# EAGLE design canSlaveV01a0 (EAGLE 6.3)

## Sheet 1 of 6
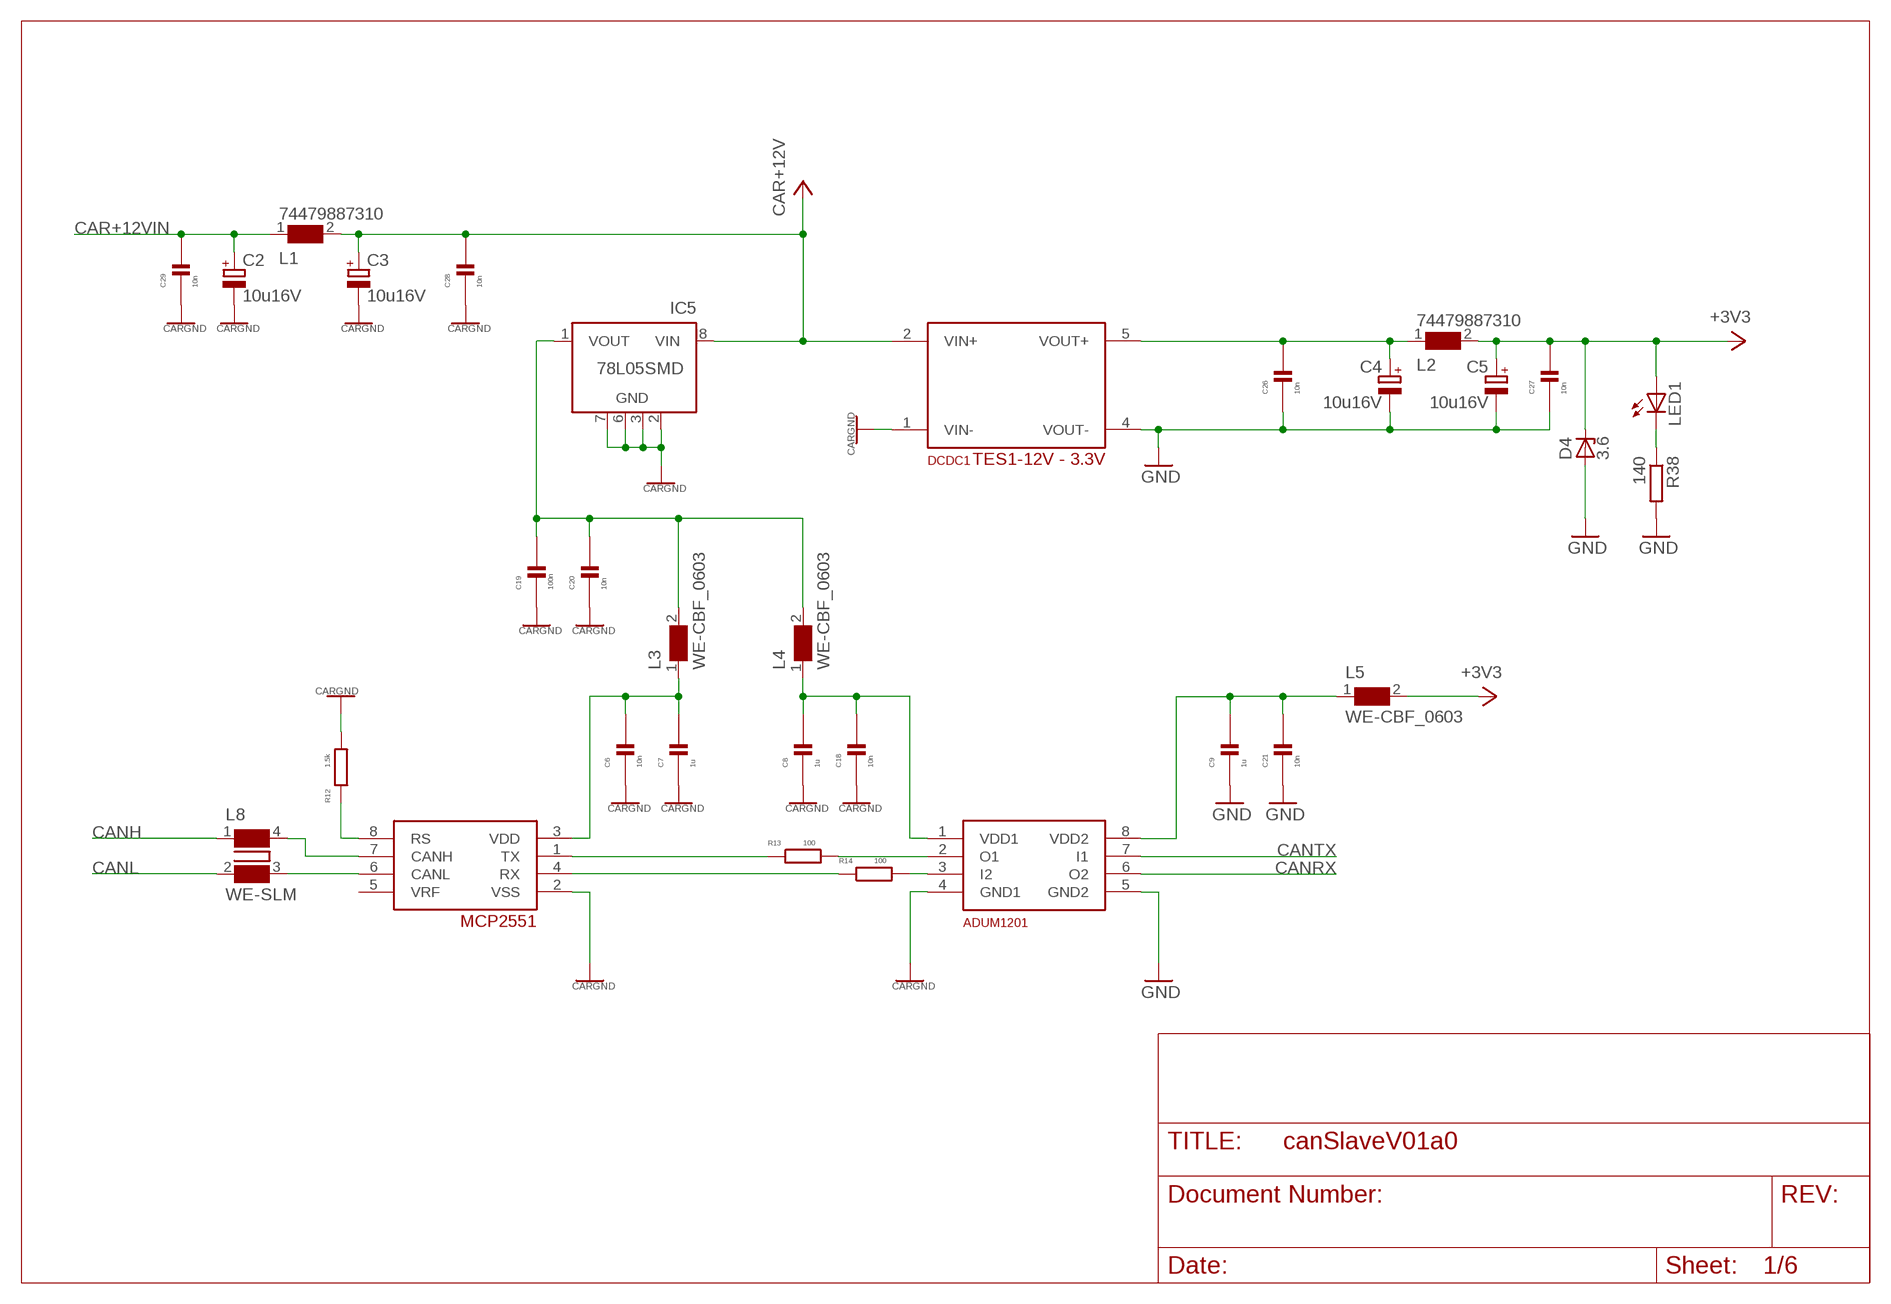
[diagram p0: schematic, sheet 1]

### Parts
C2  10u16V  CPOL-EUB  [PANASONIC_B]
C3  10u16V  CPOL-EUB  [PANASONIC_B]
C4  10u16V  CPOL-EUB  [PANASONIC_B]
C5  10u16V  CPOL-EUB  [PANASONIC_B]
C6  10n  C0603  [C0603]
C7  1u  C0603  [C0603]
C8  1u  C0603  [C0603]
C9  1u  C0603  [C0603]
C18  10n  C0603  [C0603]
C19  100n  C0603  [C0603]
C20  10n  C0603  [C0603]
C21  10n  C0603  [C0603]
C26  10n  C0603  [C0603]
C27  10n  C0603  [C0603]
C28  10n  C0603  [C0603]
C29  10n  C0603  [C0603]
D4  3.6  ZENER-DIODESOD323  [SOD323-W]
DCDC1  TES1-12V - 3.3V  ISFXXXXA  [ISF]
IC3  ADUM1201  [SO-8]
IC4  MCP2551  [SO-8]
IC5  78L05SMD  [SO08]
L1  74479887310  WE-PMI_1008  [WE-PMI_1008]
L2  74479887310  WE-PMI_1008  [WE-PMI_1008]
L3  WE-CBF_0603  [0603]
L4  WE-CBF_0603  [0603]
L5  WE-CBF_0603  [0603]
L8  WE-SLM  [WE-SLM]
LED1  LEDCHIPLED_1206  [CHIPLED_1206]
R12  1.5k  R0603  [R0603]
R13  100  R0603  [R0603]
R14  100  R0603  [R0603]
R38  140  R-EU_R1206  [R1206]

### Nets
+3V3: C5.+ C27.1 D4.C L2.2 L5.2 LED1.A ; also sheet 2,3,5
+3V3_AD: C9.1 C21.1 IC3.8(VDD2) L5.1
+3V3DCOUT: C4.+ C26.1 DCDC1.5(VOUT+) L2.1
CANH: L8.1 ; also sheet 6
CANHC: IC4.7(CANH) L8.4
CANL: L8.2 ; also sheet 6
CANLC: IC4.6(CANL) L8.3
CANRX: IC3.6(O2) ; also sheet 2
CANTX: IC3.7(I1) ; also sheet 2
CAR+5V: C19.1 C20.1 IC5.1(VOUT) L3.2 L4.2
CAR+5V_AD: C8.1 C18.1 IC3.1(VDD1) L4.1
CAR+5V_CT: C6.1 C7.1 IC4.3(VDD) L3.1
CAR+12V: C3.+ C28.1 DCDC1.2(VIN+) IC5.8(VIN) L1.2
CAR+12VIN: C2.+ C29.1 L1.1 ; also sheet 6
CAR_CANRX: IC3.3(I2) R14.2
CAR_CANRX_T: IC4.4(RX) R14.1
CAR_CANTX: IC3.2(O1) R13.2
CAR_CANTX_T: IC4.1(TX) R13.1
CARGND: C2.- C3.- C6.2 C7.2 C8.2 C18.2 C19.2 C20.2 C28.2 C29.2 DCDC1.1(VIN-) IC3.4(GND1) IC4.2(VSS) IC5.2(GND) IC5.3(GND) IC5.6(GND) IC5.7(GND) R12.2 ; also sheet 6
GND: C4.- C5.- C9.2 C21.2 C26.2 C27.2 D4.A DCDC1.4(VOUT-) IC3.5(GND2) R38.2 ; also sheet 2,3,5,6
LED1C: LED1.C R38.1
RS: IC4.8(RS) R12.1
Unconnected: IC4.5(VRF) IC5.4(NC) IC5.5(NC)

## Sheet 2 of 6
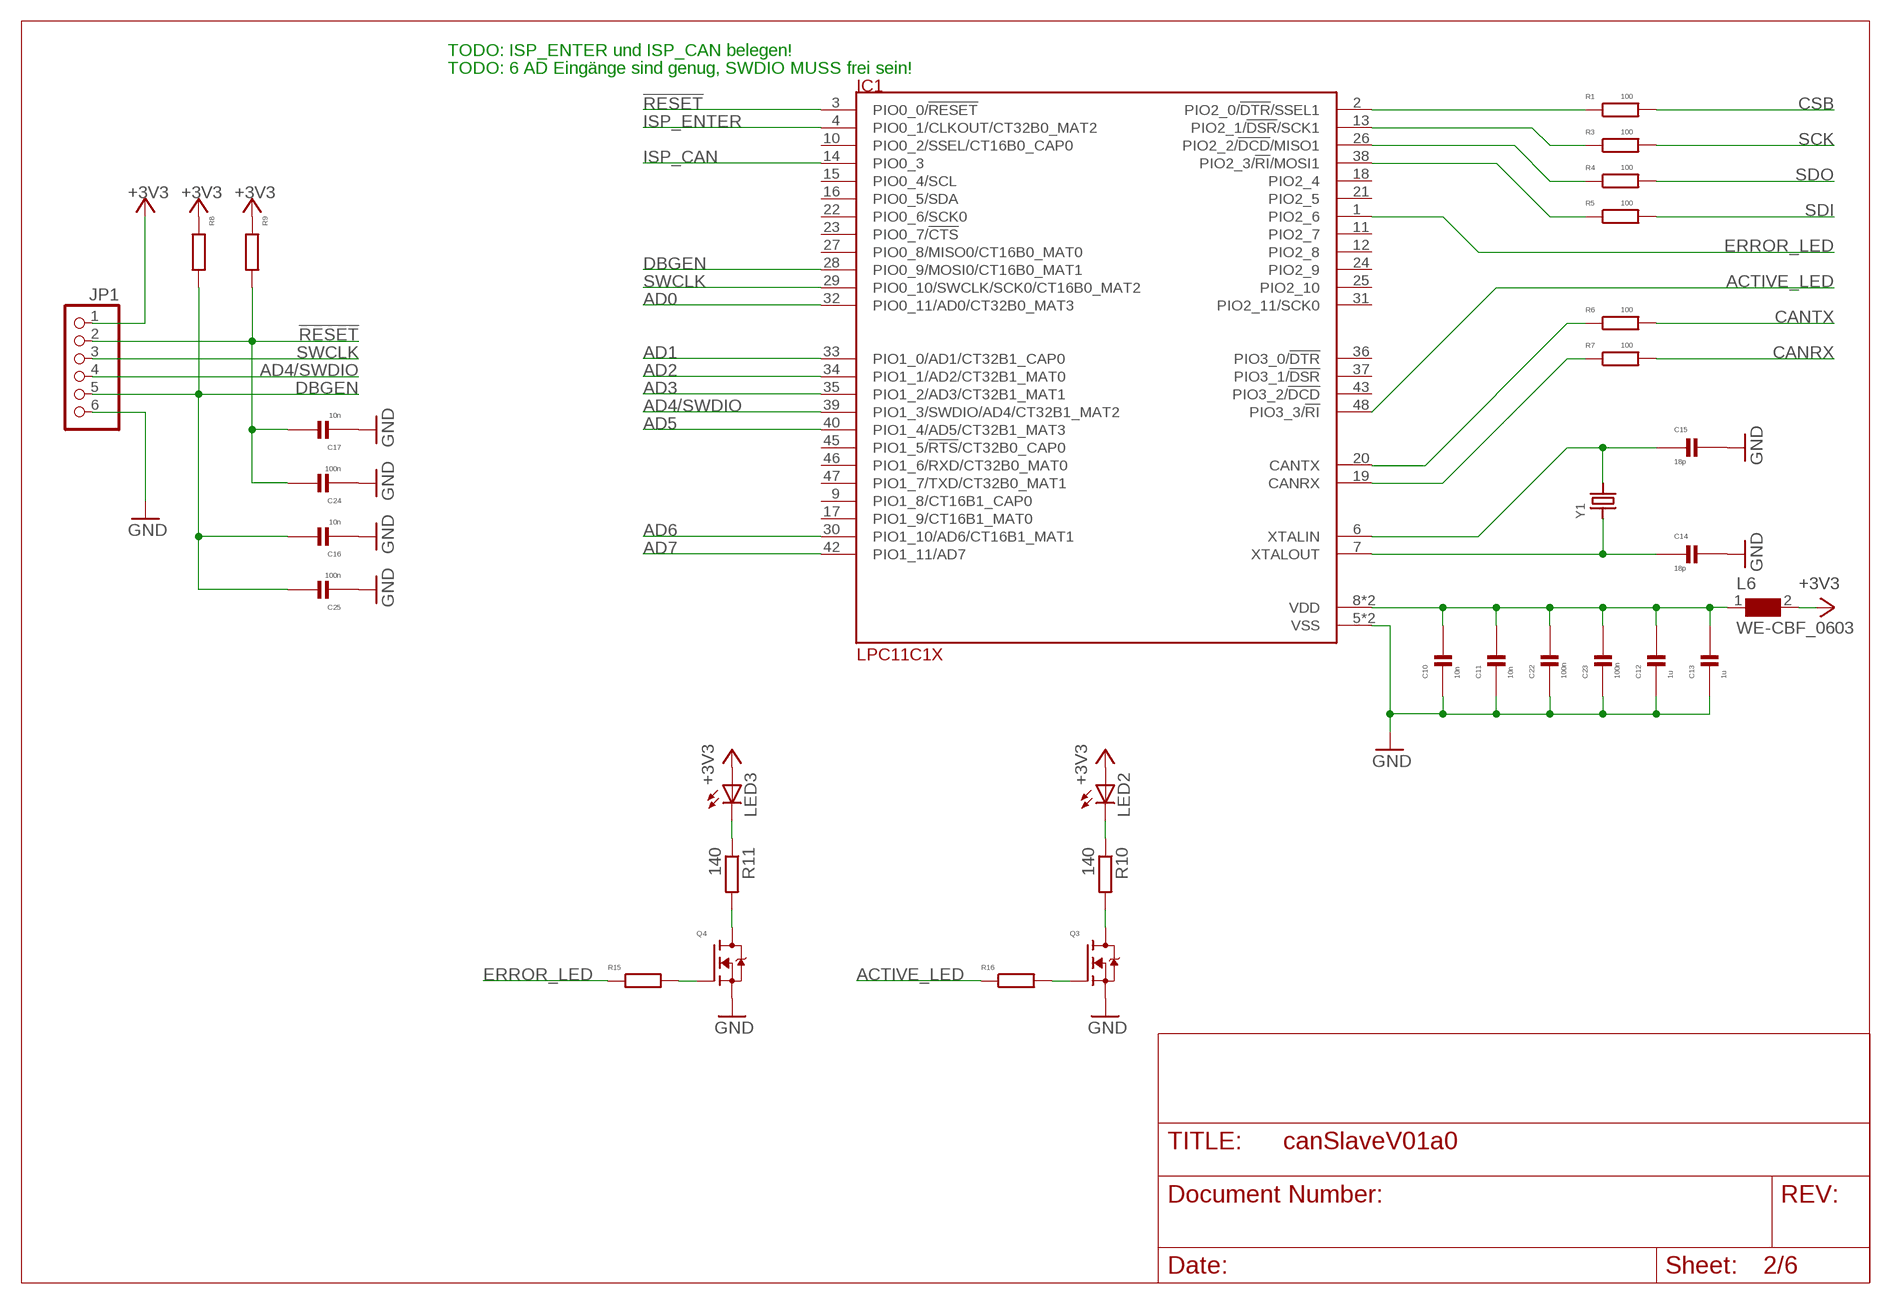
[diagram p1: schematic, sheet 2]

### Parts
C10  10n  C0603  [C0603]
C11  10n  C0603  [C0603]
C12  1u  C0603  [C0603]
C13  1u  C0603  [C0603]
C14  18p  C0603  [C0603]
C15  18p  C0603  [C0603]
C16  10n  C0603  [C0603]
C17  10n  C0603  [C0603]
C22  100n  C0603  [C0603]
C23  100n  C0603  [C0603]
C24  100n  C0603  [C0603]
C25  100n  C0603  [C0603]
IC1  LPC11C1X  [LQFP48]
JP1  PINHD-1X6  [1X06]
L6  WE-CBF_0603  [0603]
LED2  LEDCHIPLED_1206  [CHIPLED_1206]
LED3  LEDCHIPLED_1206  [CHIPLED_1206]
Q3  2N7002  [SOT23]
Q4  2N7002  [SOT23]
R1  100  R0603  [R0603]
R3  100  R0603  [R0603]
R4  100  R0603  [R0603]
R5  100  R0603  [R0603]
R6  100  R0603  [R0603]
R7  100  R0603  [R0603]
R8  R0603  [R0603]
R9  R0603  [R0603]
R10  140  R-EU_R1206  [R1206]
R11  140  R-EU_R1206  [R1206]
R15  R0603  [R0603]
R16  R0603  [R0603]
Y1  CRYSTALTHIN  [CRYSTAL_3.2X2.5]

### Nets
!RESET: C17.1 C24.1 IC1.3(PIO0_0/!RESET) JP1.2 R9.2
+3V3: JP1.1 L6.2 LED2.A LED3.A R8.1 R9.1 ; also sheet 1,3,5
+3V3_UC: C10.1 C11.1 C12.1 C13.1 C22.1 C23.1 IC1.8(VDD) IC1.44(VDD) L6.1
ACTIVE_LED: IC1.48(PIO3_3/!RI) R16.1
ACTIVE_LED_G: Q3.1(G) R16.2
AD0: IC1.32(PIO0_11/AD0/CT32B0_MAT3) ; also sheet 5,6
AD1: IC1.33(PIO1_0/AD1/CT32B1_CAP0) ; also sheet 5,6
AD2: IC1.34(PIO1_1/AD2/CT32B1_MAT0) ; also sheet 5,6
AD3: IC1.35(PIO1_2/AD3/CT32B1_MAT1) ; also sheet 5,6
AD4/SWDIO: IC1.39(PIO1_3/SWDIO/AD4/CT32B1_MAT2) JP1.4 ; also sheet 5,6
AD5: IC1.40(PIO1_4/AD5/CT32B1_MAT3) ; also sheet 5,6
AD6: IC1.30(PIO1_10/AD6/CT16B1_MAT1) ; also sheet 5,6
AD7: IC1.42(PIO1_11/AD7) ; also sheet 5,6
CANRX: R7.2 ; also sheet 1
CANRX_U: IC1.19(CANRX) R7.1
CANTX: R6.2 ; also sheet 1
CANTX_U: IC1.20(CANTX) R6.1
CSB: R1.2 ; also sheet 3
DBGEN: C16.1 C25.1 IC1.28(PIO0_9/MOSI0/CT16B0_MAT1) JP1.5 R8.2
ERROR_LED: IC1.1(PIO2_6) R15.1
ERROR_LED_G: Q4.1(G) R15.2
GND: C10.2 C11.2 C12.2 C13.2 C14.1 C15.1 C16.2 C17.2 C22.2 C23.2 C24.2 C25.2 IC1.5(VSS) IC1.41(VSS) JP1.6 Q3.2(S) Q4.2(S) ; also sheet 1,3,5,6
ISP_CAN: IC1.14(PIO0_3)
ISP_ENTER: IC1.4(PIO0_1/CLKOUT/CT32B0_MAT2)
LED1C1: LED2.C R10.1
LED1C2: LED3.C R11.1
MISO1: IC1.26(PIO2_2/!DCD!/MISO1) R4.1
MOSI1: IC1.38(PIO2_3/!RI!/MOSI1) R5.1
Q3_COL: Q3.3(D) R10.2
Q3_COL1: Q4.3(D) R11.2
SCK: R3.2 ; also sheet 3
SCK1: IC1.13(PIO2_1/!DSR!/SCK1) R3.1
SDI: R5.2 ; also sheet 3
SDO: R4.2 ; also sheet 3
SSEL: IC1.2(PIO2_0/!DTR!/SSEL1) R1.1
SWCLK: IC1.29(PIO0_10/SWCLK/SCK0/CT16B0_MAT2) JP1.3
XTALIN: C15.2 IC1.6(XTALIN) Y1.2
XTALOUT: C14.2 IC1.7(XTALOUT) Y1.1
Unconnected: IC1.9(PIO1_8/CT16B1_CAP0) IC1.10(PIO0_2/SSEL/CT16B0_CAP0) IC1.11(PIO2_7) IC1.12(PIO2_8) IC1.15(PIO0_4/SCL) IC1.16(PIO0_5/SDA) IC1.17(PIO1_9/CT16B1_MAT0) IC1.18(PIO2_4) IC1.21(PIO2_5) IC1.22(PIO0_6/SCK0) IC1.23(PIO0_7/!CTS) IC1.24(PIO2_9) IC1.25(PIO2_10) IC1.27(PIO0_8/MISO0/CT16B0_MAT0) IC1.31(PIO2_11/SCK0) IC1.36(PIO3_0/!DTR) IC1.37(PIO3_1/!DSR) IC1.43(PIO3_2/!DCD) IC1.45(PIO1_5/!RTS!/CT32B0_CAP0) IC1.46(PIO1_6/RXD/CT32B0_MAT0) IC1.47(PIO1_7/TXD/CT32B0_MAT1)

### Notes on the sheet
- TODO: ISP_ENTER und ISP_CAN belegen!
- TODO: 6 AD Eingänge sind genug, SWDIO MUSS frei sein!

## Sheet 3 of 6
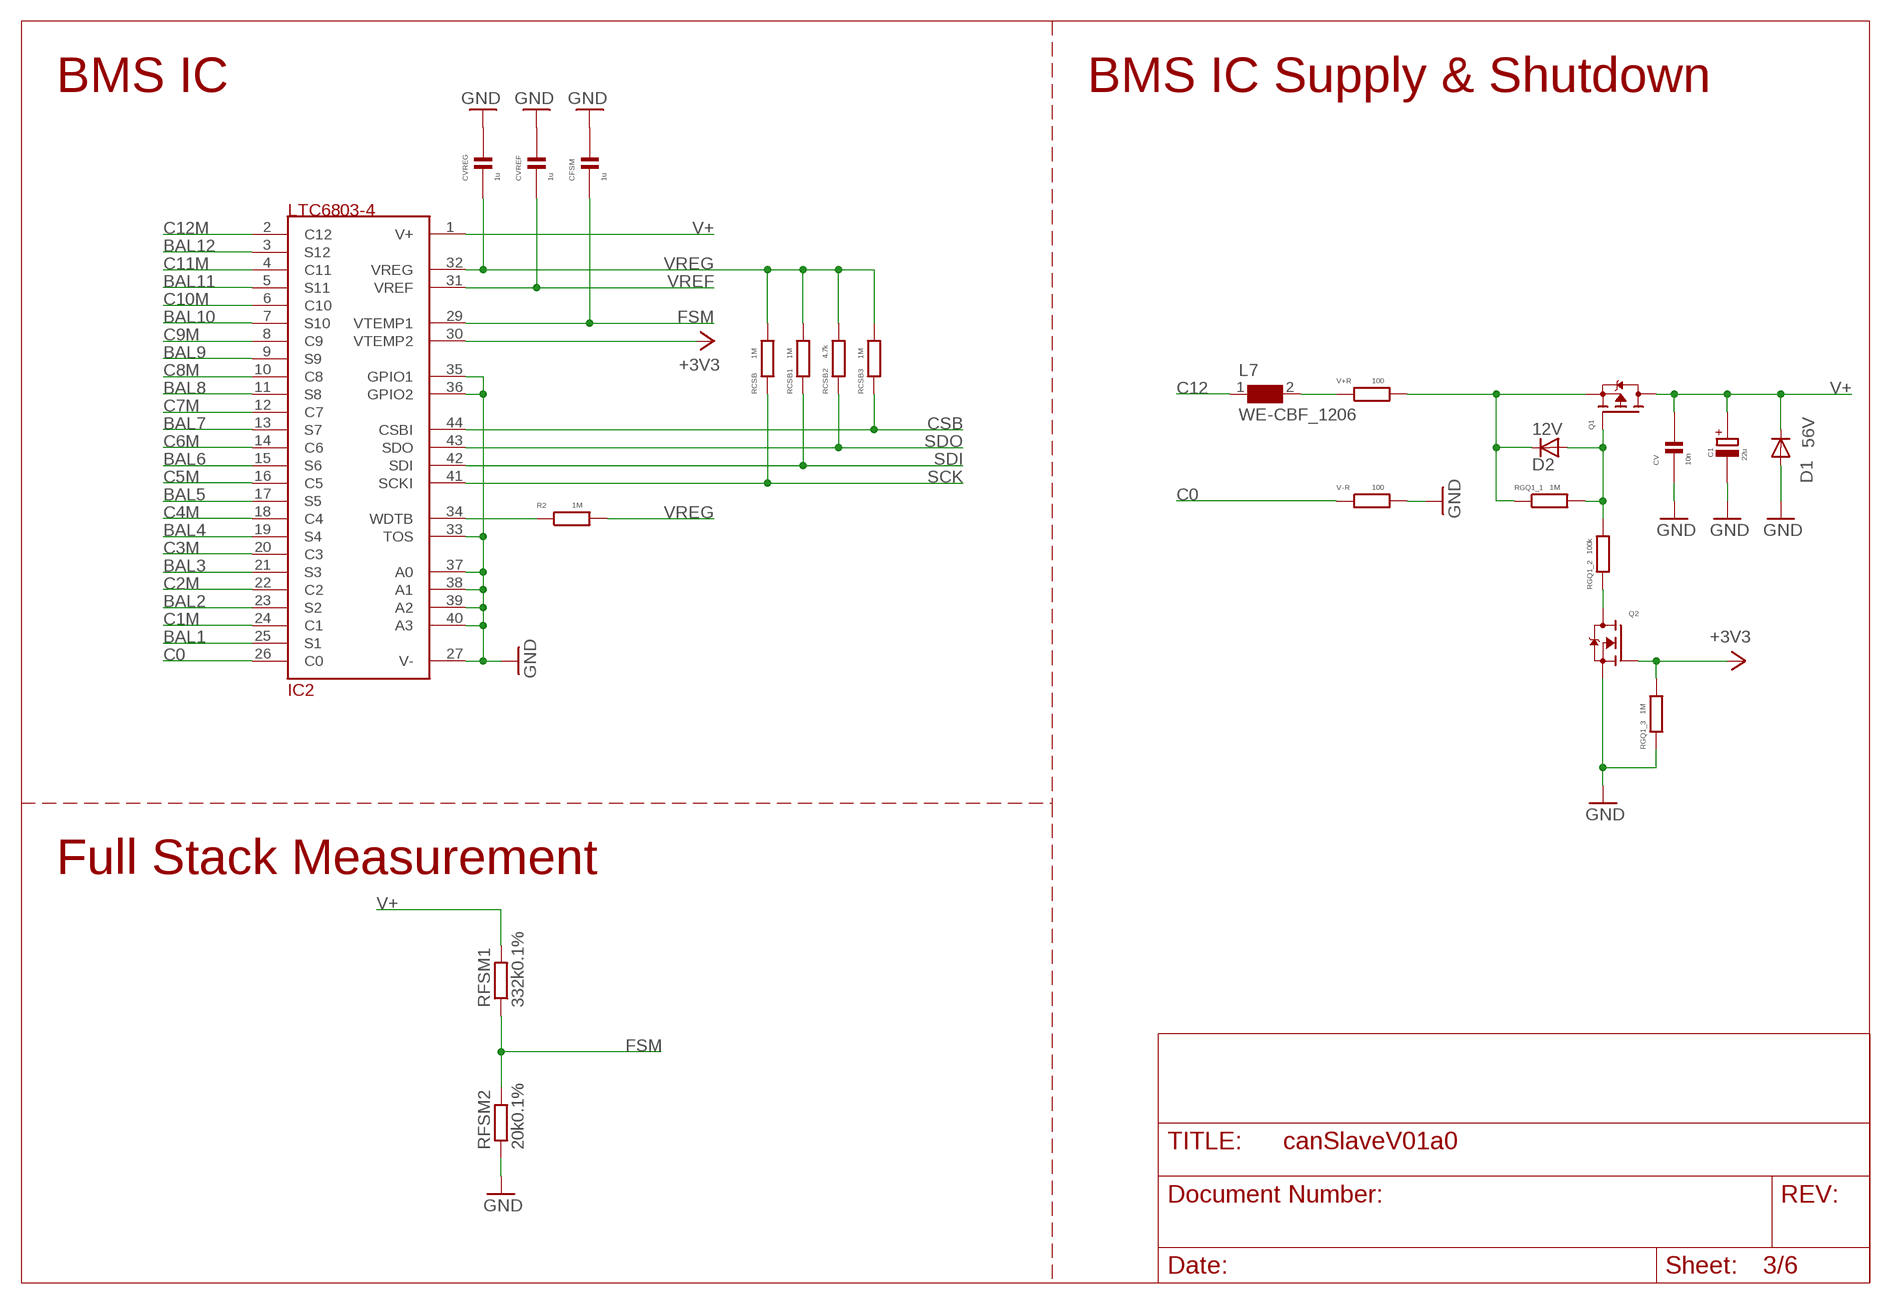
[diagram p2: schematic, sheet 3]

### Parts
C1  22u  CPOLEF  [PANASONIC_F]
CFSM  1u  C0603  [C0603]
CV  10n  C1206  [C1206]
CVREF  1u  C0603  [C0603]
CVREG  1u  C0603  [C0603]
D1  56V  DIODE-SOD123  [SOD123]
D2  12V  DIODE-SOD323-R  [SOD323-R]
IC2  LTC6803-4  [44SSOP]
L7  WE-CBF_1206  [1206]
Q1  TP0610K  [SOT23]
Q2  2N7002  [SOT23]
R2  1M  R0603  [R0603]
RCSB  1M  R0603  [R0603]
RCSB1  1M  R0603  [R0603]
RCSB2  4.7k  R0603  [R0603]
RCSB3  1M  R0603  [R0603]
RFSM1  332k0.1%  R-EU_R0603  [R0603]
RFSM2  20k0.1%  R-EU_R0603  [R0603]
RGQ1_1  1M  R0805  [R0805]
RGQ1_2  100k  R0805  [R0805]
RGQ1_3  1M  R0603  [R0603]
V+R  100  R0805  [R0805]
V-R  100  R0805  [R0805]

### Nets
+3V3: IC2.30(VTEMP2) Q2.1(G) RGQ1_3.2 ; also sheet 1,2,5
BAL1: IC2.25(S1) ; also sheet 4
BAL2: IC2.23(S2) ; also sheet 4
BAL3: IC2.21(S3) ; also sheet 4
BAL4: IC2.19(S4) ; also sheet 4
BAL5: IC2.17(S5) ; also sheet 4
BAL6: IC2.15(S6) ; also sheet 4
BAL7: IC2.13(S7) ; also sheet 4
BAL8: IC2.11(S8) ; also sheet 4
BAL9: IC2.9(S9) ; also sheet 4
BAL10: IC2.7(S10) ; also sheet 4
BAL11: IC2.5(S11) ; also sheet 4
BAL12: IC2.3(S12) ; also sheet 4
C0: IC2.26(C0) V-R.1 ; also sheet 4,6
C1M: IC2.24(C1) ; also sheet 4
C2M: IC2.22(C2) ; also sheet 4
C3M: IC2.20(C3) ; also sheet 4
C4M: IC2.18(C4) ; also sheet 4
C5M: IC2.16(C5) ; also sheet 4
C6M: IC2.14(C6) ; also sheet 4
C7M: IC2.12(C7) ; also sheet 4
C8M: IC2.10(C8) ; also sheet 4
C9M: IC2.8(C9) ; also sheet 4
C10M: IC2.6(C10) ; also sheet 4
C11M: IC2.4(C11) ; also sheet 4
C12: L7.1 ; also sheet 4,6
C12F: L7.2 V+R.1
C12M: IC2.2(C12) ; also sheet 4
CSB: IC2.44(CSBI) RCSB3.1 ; also sheet 2
FSM: CFSM.2 IC2.29(VTEMP1) RFSM1.1 RFSM2.2
GND: C1.- CFSM.1 CV.2 CVREF.1 CVREG.1 D1.A IC2.27(V-) IC2.33(TOS) IC2.35(GPIO1) IC2.36(GPIO2) IC2.37(A0) IC2.38(A1) IC2.39(A2) IC2.40(A3) Q2.2(S) RFSM2.1 RGQ1_3.1 V-R.2 ; also sheet 1,2,5,6
Q1G: D2.A Q1.1(G) RGQ1_1.2 RGQ1_2.2
Q2D: Q2.3(D) RGQ1_2.1
SCK: IC2.41(SCKI) RCSB.1 ; also sheet 2
SDI: IC2.42(SDI) RCSB1.1 ; also sheet 2
SDO: IC2.43(SDO) RCSB2.1 ; also sheet 2
V+: C1.+ CV.1 D1.C IC2.1(V+) Q1.3(D) RFSM1.2
V+S: D2.C Q1.2(S) RGQ1_1.1 V+R.2
VREF: CVREF.2 IC2.31(VREF)
VREG: CVREG.2 IC2.32(VREG) R2.2 RCSB1.2 RCSB2.2 RCSB3.2 RCSB.2
WDTB: IC2.34(WDTB) R2.1

### Notes on the sheet
- BMS IC | BMS IC Supply & Shutdown
- Full Stack Measurement

## Sheet 4 of 6
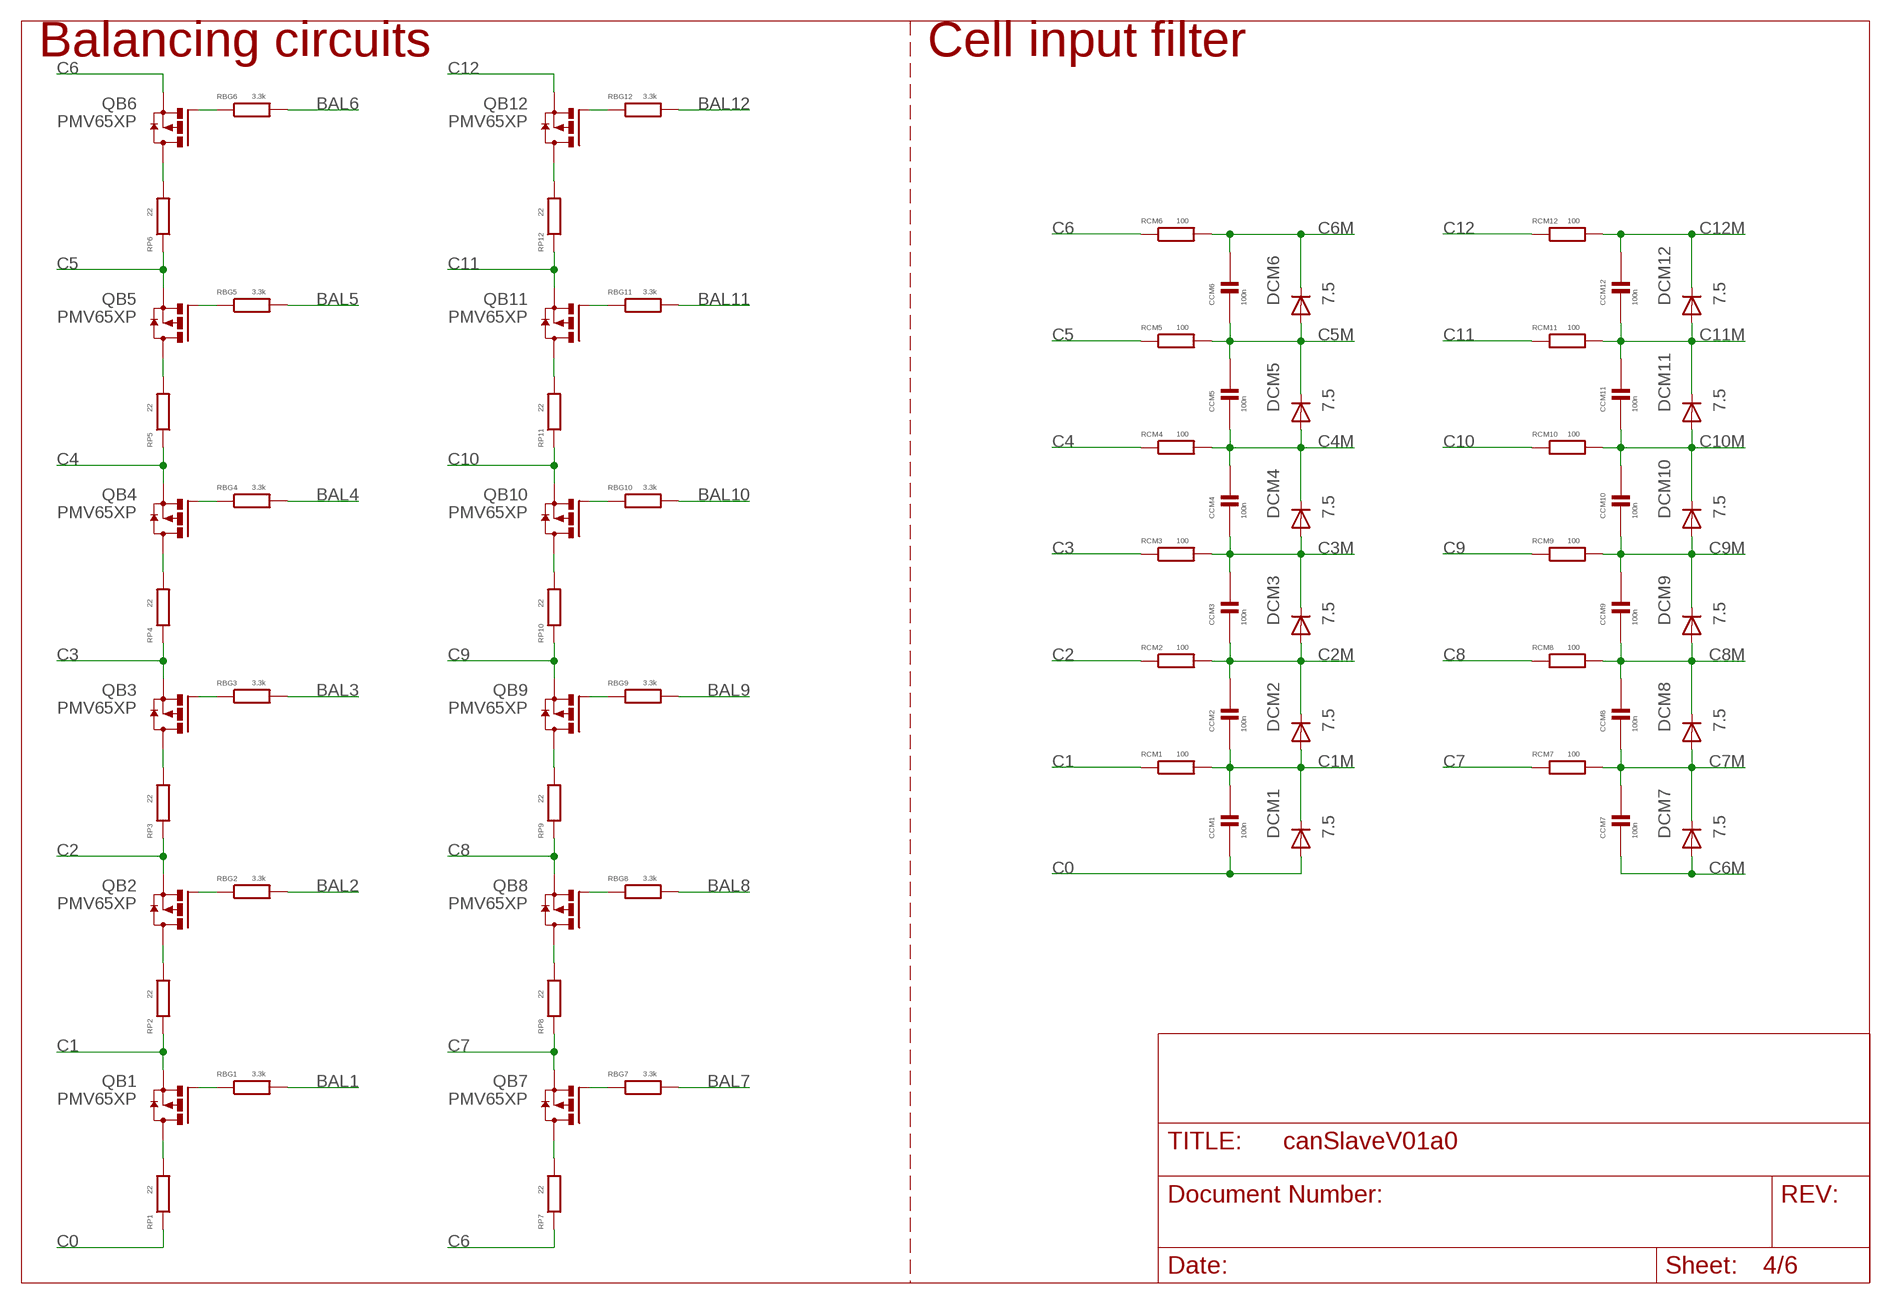
[diagram p3: schematic, sheet 4]

### Parts
CCM1  100n  C0603  [C0603]
CCM2  100n  C0603  [C0603]
CCM3  100n  C0603  [C0603]
CCM4  100n  C0603  [C0603]
CCM5  100n  C0603  [C0603]
CCM6  100n  C0603  [C0603]
CCM7  100n  C0603  [C0603]
CCM8  100n  C0603  [C0603]
CCM9  100n  C0603  [C0603]
CCM10  100n  C0603  [C0603]
CCM11  100n  C0603  [C0603]
CCM12  100n  C0603  [C0603]
DCM1  7.5  DIODE-SOD323-R  [SOD323-R]
DCM2  7.5  DIODE-SOD323-R  [SOD323-R]
DCM3  7.5  DIODE-SOD323-R  [SOD323-R]
DCM4  7.5  DIODE-SOD323-R  [SOD323-R]
DCM5  7.5  DIODE-SOD323-R  [SOD323-R]
DCM6  7.5  DIODE-SOD323-R  [SOD323-R]
DCM7  7.5  DIODE-SOD323-R  [SOD323-R]
DCM8  7.5  DIODE-SOD323-R  [SOD323-R]
DCM9  7.5  DIODE-SOD323-R  [SOD323-R]
DCM10  7.5  DIODE-SOD323-R  [SOD323-R]
DCM11  7.5  DIODE-SOD323-R  [SOD323-R]
DCM12  7.5  DIODE-SOD323-R  [SOD323-R]
QB1  PMV65XP  FDN360P  [SUPER-SOT3]
QB2  PMV65XP  FDN360P  [SUPER-SOT3]
QB3  PMV65XP  FDN360P  [SUPER-SOT3]
QB4  PMV65XP  FDN360P  [SUPER-SOT3]
QB5  PMV65XP  FDN360P  [SUPER-SOT3]
QB6  PMV65XP  FDN360P  [SUPER-SOT3]
QB7  PMV65XP  FDN360P  [SUPER-SOT3]
QB8  PMV65XP  FDN360P  [SUPER-SOT3]
QB9  PMV65XP  FDN360P  [SUPER-SOT3]
QB10  PMV65XP  FDN360P  [SUPER-SOT3]
QB11  PMV65XP  FDN360P  [SUPER-SOT3]
QB12  PMV65XP  FDN360P  [SUPER-SOT3]
RBG1  3.3k  R0603  [R0603]
RBG2  3.3k  R0603  [R0603]
RBG3  3.3k  R0603  [R0603]
RBG4  3.3k  R0603  [R0603]
RBG5  3.3k  R0603  [R0603]
RBG6  3.3k  R0603  [R0603]
RBG7  3.3k  R0603  [R0603]
RBG8  3.3k  R0603  [R0603]
RBG9  3.3k  R0603  [R0603]
RBG10  3.3k  R0603  [R0603]
RBG11  3.3k  R0603  [R0603]
RBG12  3.3k  R0603  [R0603]
RCM1  100  R0603  [R0603]
RCM2  100  R0603  [R0603]
RCM3  100  R0603  [R0603]
RCM4  100  R0603  [R0603]
RCM5  100  R0603  [R0603]
RCM6  100  R0603  [R0603]
RCM7  100  R0603  [R0603]
RCM8  100  R0603  [R0603]
RCM9  100  R0603  [R0603]
RCM10  100  R0603  [R0603]
RCM11  100  R0603  [R0603]
RCM12  100  R0603  [R0603]
RP1  22  R2512  [R2512]
RP2  22  R2512  [R2512]
RP3  22  R2512  [R2512]
RP4  22  R2512  [R2512]
RP5  22  R2512  [R2512]
RP6  22  R2512  [R2512]
RP7  22  R2512  [R2512]
RP8  22  R2512  [R2512]
RP9  22  R2512  [R2512]
RP10  22  R2512  [R2512]
RP11  22  R2512  [R2512]
RP12  22  R2512  [R2512]

### Nets
BAL1: RBG1.2 ; also sheet 3
BAL2: RBG2.2 ; also sheet 3
BAL3: RBG3.2 ; also sheet 3
BAL4: RBG4.2 ; also sheet 3
BAL5: RBG5.2 ; also sheet 3
BAL6: RBG6.2 ; also sheet 3
BAL7: RBG7.2 ; also sheet 3
BAL8: RBG8.2 ; also sheet 3
BAL9: RBG9.2 ; also sheet 3
BAL10: RBG10.2 ; also sheet 3
BAL11: RBG11.2 ; also sheet 3
BAL12: RBG12.2 ; also sheet 3
C0: CCM1.2 DCM1.A RP1.1 ; also sheet 3,6
C1: QB1.2(S) RCM1.1 RP2.1 ; also sheet 6
C1M: CCM1.1 CCM2.2 DCM1.C DCM2.A RCM1.2 ; also sheet 3
C2: QB2.2(S) RCM2.1 RP3.1 ; also sheet 6
C2M: CCM2.1 CCM3.2 DCM2.C DCM3.A RCM2.2 ; also sheet 3
C3: QB3.2(S) RCM3.1 RP4.1 ; also sheet 6
C3M: CCM3.1 CCM4.2 DCM3.C DCM4.A RCM3.2 ; also sheet 3
C4: QB4.2(S) RCM4.1 RP5.1 ; also sheet 6
C4M: CCM4.1 CCM5.2 DCM4.C DCM5.A RCM4.2 ; also sheet 3
C5: QB5.2(S) RCM5.1 RP6.1 ; also sheet 6
C5M: CCM5.1 CCM6.2 DCM5.C DCM6.A RCM5.2 ; also sheet 3
C6: QB6.2(S) RCM6.1 RP7.1 ; also sheet 6
C6M: CCM6.1 CCM7.2 DCM6.C DCM7.A RCM6.2 ; also sheet 3
C7: QB7.2(S) RCM7.1 RP8.1 ; also sheet 6
C7M: CCM7.1 CCM8.2 DCM7.C DCM8.A RCM7.2 ; also sheet 3
C8: QB8.2(S) RCM8.1 RP9.1 ; also sheet 6
C8M: CCM8.1 CCM9.2 DCM8.C DCM9.A RCM8.2 ; also sheet 3
C9: QB9.2(S) RCM9.1 RP10.1 ; also sheet 6
C9M: CCM9.1 CCM10.2 DCM9.C DCM10.A RCM9.2 ; also sheet 3
C10: QB10.2(S) RCM10.1 RP11.1 ; also sheet 6
C10M: CCM10.1 CCM11.2 DCM10.C DCM11.A RCM10.2 ; also sheet 3
C11: QB11.2(S) RCM11.1 RP12.1 ; also sheet 6
C11M: CCM11.1 CCM12.2 DCM11.C DCM12.A RCM11.2 ; also sheet 3
C12: QB12.2(S) RCM12.1 ; also sheet 3,6
C12M: CCM12.1 DCM12.C RCM12.2 ; also sheet 3
CR1: QB1.3(D) RP1.2
CR2: QB2.3(D) RP2.2
CR3: QB3.3(D) RP3.2
CR4: QB4.3(D) RP4.2
CR5: QB5.3(D) RP5.2
CR6: QB6.3(D) RP6.2
CR7: QB7.3(D) RP7.2
CR8: QB8.3(D) RP8.2
CR9: QB9.3(D) RP9.2
CR10: QB10.3(D) RP10.2
CR11: QB11.3(D) RP11.2
CR12: QB12.3(D) RP12.2
QBG1: QB1.1(G) RBG1.1
QBG2: QB2.1(G) RBG2.1
QBG3: QB3.1(G) RBG3.1
QBG4: QB4.1(G) RBG4.1
QBG5: QB5.1(G) RBG5.1
QBG6: QB6.1(G) RBG6.1
QBG7: QB7.1(G) RBG7.1
QBG8: QB8.1(G) RBG8.1
QBG9: QB9.1(G) RBG9.1
QBG10: QB10.1(G) RBG10.1
QBG11: QB11.1(G) RBG11.1
QBG12: QB12.1(G) RBG12.1

### Notes on the sheet
- Balancing circuits | Cell input filter

## Sheet 5 of 6
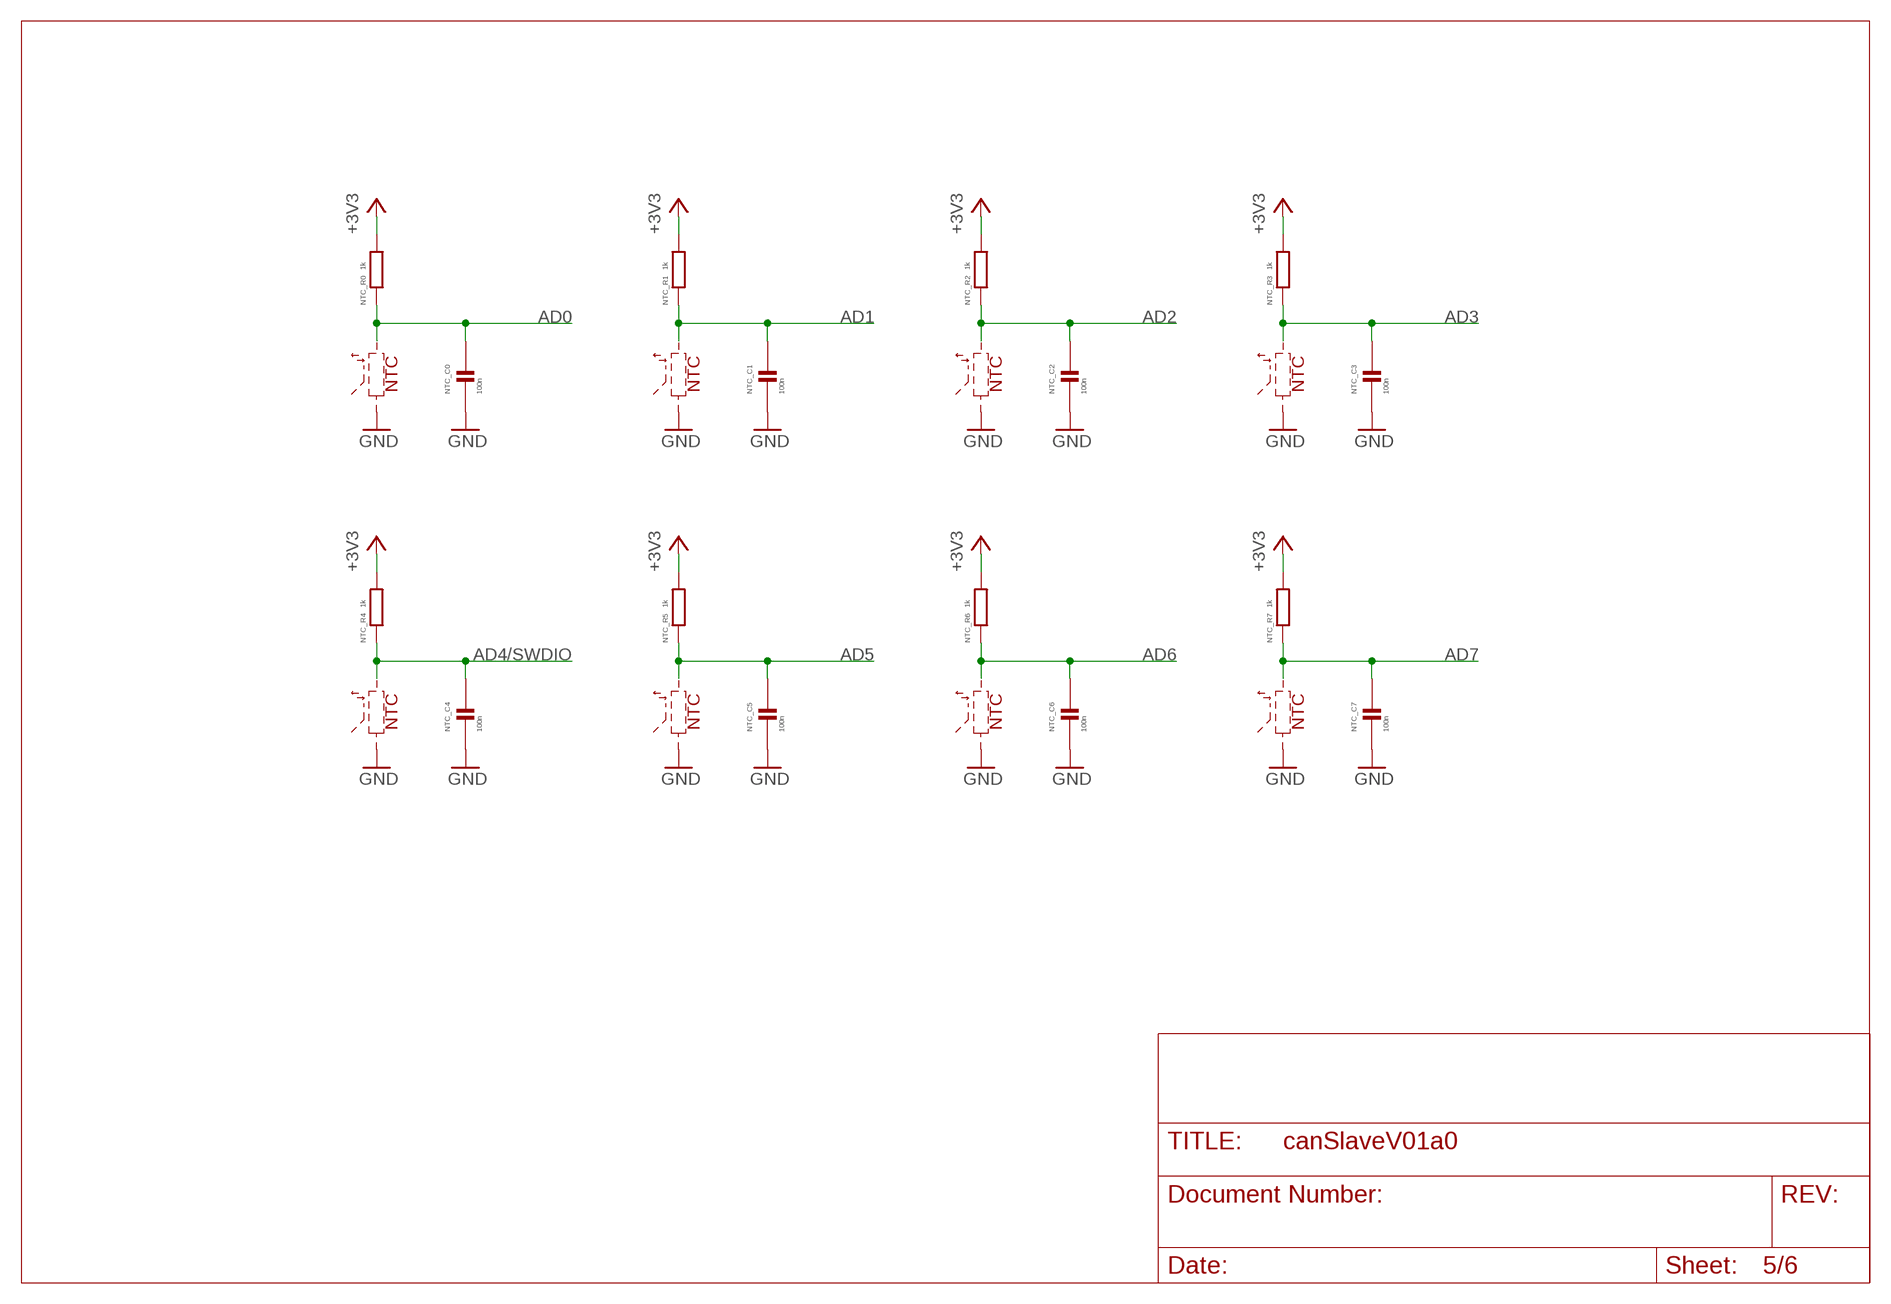
[diagram p4: schematic, sheet 5]

### Parts
NTC_C0  100n  C0603  [C0603]
NTC_C1  100n  C0603  [C0603]
NTC_C2  100n  C0603  [C0603]
NTC_C3  100n  C0603  [C0603]
NTC_C4  100n  C0603  [C0603]
NTC_C5  100n  C0603  [C0603]
NTC_C6  100n  C0603  [C0603]
NTC_C7  100n  C0603  [C0603]
NTC_R0  1k  R0603  [R0603]
NTC_R1  1k  R0603  [R0603]
NTC_R2  1k  R0603  [R0603]
NTC_R3  1k  R0603  [R0603]
NTC_R4  1k  R0603  [R0603]
NTC_R5  1k  R0603  [R0603]
NTC_R6  1k  R0603  [R0603]
NTC_R7  1k  R0603  [R0603]

### Nets
+3V3: NTC_R0.2 NTC_R1.2 NTC_R2.2 NTC_R3.2 NTC_R4.2 NTC_R5.2 NTC_R6.2 NTC_R7.2 ; also sheet 1,2,3
AD0: NTC_C0.1 NTC_R0.1 ; also sheet 2,6
AD1: NTC_C1.1 NTC_R1.1 ; also sheet 2,6
AD2: NTC_C2.1 NTC_R2.1 ; also sheet 2,6
AD3: NTC_C3.1 NTC_R3.1 ; also sheet 2,6
AD4/SWDIO: NTC_C4.1 NTC_R4.1 ; also sheet 2,6
AD5: NTC_C5.1 NTC_R5.1 ; also sheet 2,6
AD6: NTC_C6.1 NTC_R6.1 ; also sheet 2,6
AD7: NTC_C7.1 NTC_R7.1 ; also sheet 2,6
GND: NTC_C0.2 NTC_C1.2 NTC_C2.2 NTC_C3.2 NTC_C4.2 NTC_C5.2 NTC_C6.2 NTC_C7.2 ; also sheet 1,2,3,6

### Notes on the sheet
- NTC | NTC | NTC | NTC
- NTC | NTC | NTC | NTC

## Sheet 6 of 6
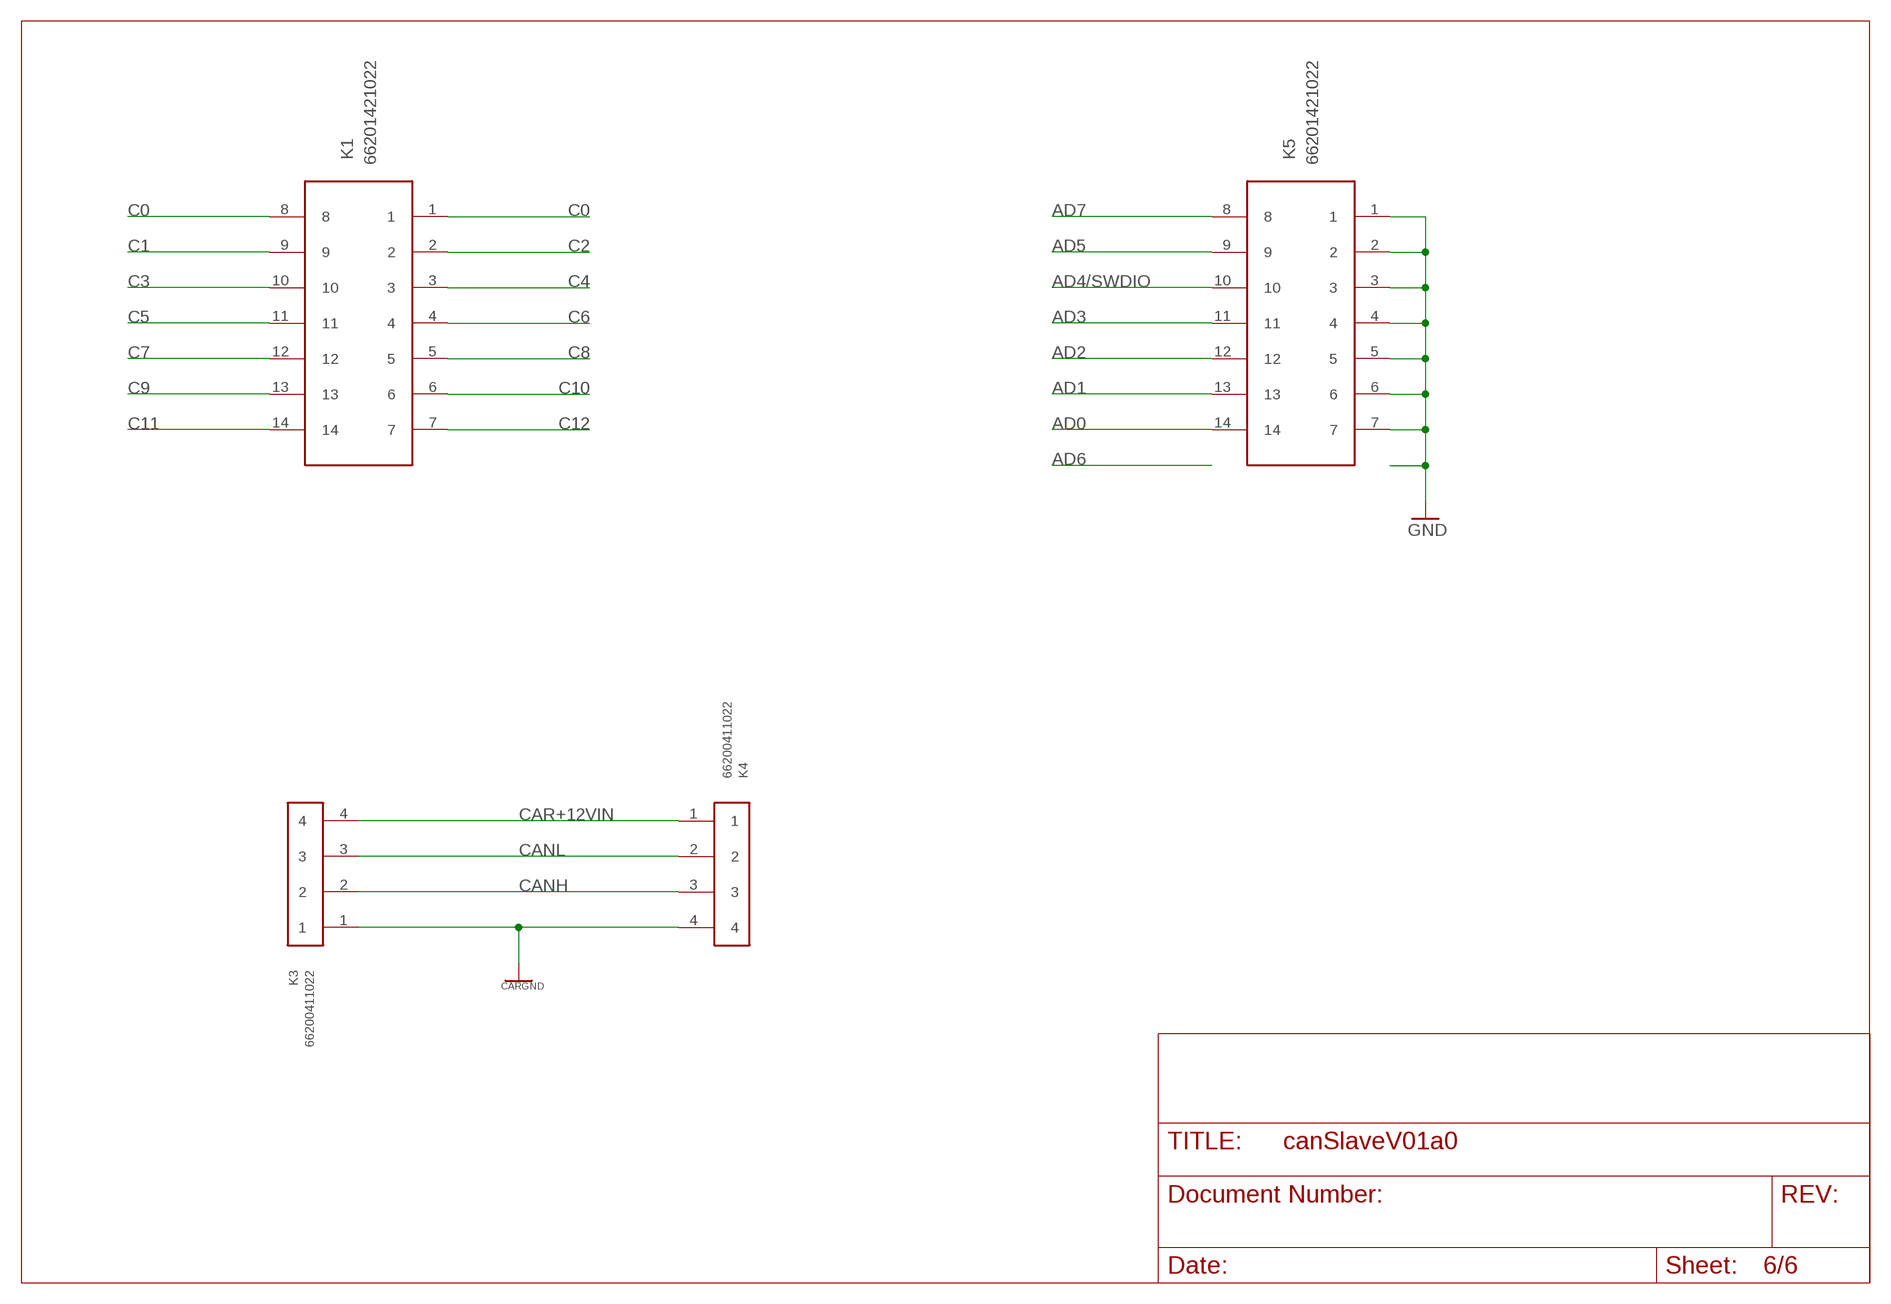
[diagram p5: schematic, sheet 6]

### Parts
K1  66201421022  [66201421022]
K3  66200411022  [66200411022]
K4  66200411022  [66200411022]
K5  66201421022  [66201421022]

### Nets
AD0: K5.14 ; also sheet 2,5
AD1: K5.13 ; also sheet 2,5
AD2: K5.12 ; also sheet 2,5
AD3: K5.11 ; also sheet 2,5
AD4/SWDIO: K5.10 ; also sheet 2,5
AD5: K5.9 ; also sheet 2,5
AD7: K5.8 ; also sheet 2,5
C0: K1.1 K1.8 ; also sheet 3,4
C1: K1.9 ; also sheet 4
C2: K1.2 ; also sheet 4
C3: K1.10 ; also sheet 4
C4: K1.3 ; also sheet 4
C5: K1.11 ; also sheet 4
C6: K1.4 ; also sheet 4
C7: K1.12 ; also sheet 4
C8: K1.5 ; also sheet 4
C9: K1.13 ; also sheet 4
C10: K1.6 ; also sheet 4
C11: K1.14 ; also sheet 4
C12: K1.7 ; also sheet 3,4
CANH: K3.2 K4.3 ; also sheet 1
CANL: K3.3 K4.2 ; also sheet 1
CAR+12VIN: K3.4 K4.1 ; also sheet 1
CARGND: K3.1 K4.4 ; also sheet 1
GND: K5.1 K5.2 K5.3 K5.4 K5.5 K5.6 K5.7 ; also sheet 1,2,3,5

## Library data of the parts
C1 = phrenetic:CPOL
C2-C5 = rcl:CPOL-EU: POLARIZED CAPACITOR, European symbol
C6-C29 CCM1-CCM12 CFSM CV CVREF CVREG NTC_C0 NTC_C1-NTC_C7 = phrenetic:C
D1 D2 DCM1-DCM12 = diode:DIODE-: DIODE
D4 = diode:ZENER-DIODE: Z-Diode
DCDC1 = bms-hsrm:ISFXXXXA
IC1 = phrenetic:LPC11C1X
IC2 = bms-hsrm:LTC6803-4
IC3 = bms-hsrm:ADUM1201
IC4 = bms-hsrm:MCP2551
IC5 = linear:78L*SMD: Positive VOLTAGE REGULATOR
JP1 = pinhead:PINHD-1X6: PIN HEADER
K1 K5 = Wuerth_Elektronik_eiCan_08_Micro_Power_Connectors:66201421022: WR-MPC3 3.00mm Male Dual Row Angled Header with Plastic Pegs, 14 Pins
K3 K4 = Wuerth_Elektronik_eiCan_08_Micro_Power_Connectors:66200411022: WR-MPC3 3.00mm Male Single Row Angled Header with Plastic Pegs, 4 Pins
L1 L2 = EagleLibrary_Wuerth_Elektronik_eiSos_Version_6-12:WE-PMI: Power Multilayer Inductor WE-PMI - Compact multilayer type - Suitable for applocations with high currents up to 2.5 A - No crosstalk -- DC / DC converters especially at high switching frequencies -- Portable devices like PDA and digital cameras
L3-L7 = EagleLibrary_Wuerth_Elektronik_eiSos_Version_6:WE-CBF: SMD EMI Suppression Ferrite Beads WE-CBF - Excellent anti-EMI properties - Low DC-restistance - Impedances till 3000 ohms - Rated current up to 6 A -- Reliable Ni-Sn electrodes -- Perfect as data lined filter and for uncoupling of distribution voltage
L8 = EagleLibrary_Wuerth_Elektronik_eiSos_Version_6:WE-SLM: SMD Common Mode Line Filter WE-SLM - Small size - Low Profile - High Impedance - High current capability up to 300 mA -- USB -- CAN -- Firewire -- Data Lines -- Power supply systems -- Signal Lines
LED1-LED3 = led:LED: LED OSRAM: - CHIPLED LG R971, LG N971, LY N971, LG Q971, LY Q971, LO R971, LY R971 LH N974, LH R974 LS Q976, LO Q976, LY Q976 LO Q996 - Hyper CHIPLED LW Q18S LB Q993, LB Q99A, LB R99A - SideLED LS A670, LO A670, LY A670, LG A670, LP A670 LB A673, LV A673, LT A673, LW A673 LH A674 LY A675 LS A676, LA A676, LO A676, LY A676, LW A676 LS A679, LY A679, LG A679 - Hyper Micro SIDELED® LS Y876, LA Y876, LO Y876, LY Y876 LT Y87S - SmartLED LW L88C, LW L88S LB L89C, LB L89S, LG L890 LS L89K, LO L89K, LY L89K LS L896, LA L896, LO L896, LY L896 - TOPLED LS T670, LO T670, LY T670, LG T670, LP T670 LSG T670, LSP T670, LSY T670, LOP T670, LYG T670 LG T671, LOG T671, LSG T671 LB T673, LV T673, LT T673, LW T673 LH T674 LS T676, LA T676, LO T676, LY T676, LB T676, LH T676, LSB T676, LW T676 LB T67C, LV T67C, LT T67C, LS T67K, LO T67K, LY T67K, LW E67C LS E67B, LA E67B, LO E67B, LY E67B, LB E67C, LV E67C, LT E67C LW T67C LS T679, LY T679, LG T679 LS T770, LO T770, LY T770, LG T770, LP T770 LB T773, LV T773, LT T773, LW T773 LH T774 LS E675, LA E675, LY E675, LS T675 LS T776, LA T776, LO T776, LY T776, LB T776 LHGB T686 LT T68C, LB T68C - Hyper Mini TOPLED® LB M676 - Mini TOPLED Santana® LG M470 LS M47K, LO M47K, LY M47K Source: http://www.osram.convergy.de LUXEON: - LUMILED® LXK2-PW12-R00, LXK2-PW12-S00, LXK2-PW14-U00, LXK2-PW14-V00 LXK2-PM12-R00, LXK2-PM12-S00, LXK2-PM14-U00 LXK2-PE12-Q00, LXK2-PE12-R00, LXK2-PE12-S00, LXK2-PE14-T00, LXK2-PE14-U00 LXK2-PB12-K00, LXK2-PB12-L00, LXK2-PB12-M00, LXK2-PB14-N00, LXK2-PB14-P00, LXK2-PB14-Q00 LXK2-PR12-L00, LXK2-PR12-M00, LXK2-PR14-Q00, LXK2-PR14-R00 LXK2-PD12-Q00, LXK2-PD12-R00, LXK2-PD12-S00 LXK2-PH12-R00, LXK2-PH12-S00 LXK2-PL12-P00, LXK2-PL12-Q00, LXK2-PL12-R00 Source: www.luxeon.com KINGBRIGHT: KA-3528ASYC Source: www.kingbright.com
NTC_R0 NTC_R1-NTC_R7 R1-R9 R12-R16 RBG1-RBG12 RCM1-RCM12 RCSB RCSB1-RCSB3 RGQ1_1-RGQ1_3 RP1-RP12 V+R V-R = phrenetic:R: RESISTOR, Bla
Q1 = phrenetic:TP0610K: SIPMOS (R) Power-Transistor P-Channel, Enhancement mode Source: http://www.infineon.com/upload/Document/cmc_upload/documents/011/3685/SPP80P06P.pdf
Q2-Q4 = phrenetic:2N7002
QB1-QB12 = transistor-power:FDN360P: Single P-Channel, PowerTrench (R) MOSFET Source: http://www.fairchildsemi.com/ds/FD/FDN360P.pdf
R10 R11 R38 RFSM1 RFSM2 = rcl:R-EU_: RESISTOR, European symbol
Y1 = microbuilder:CRYSTAL: Crystals HC49UP - Surface Mount Crystal 4.0MHz 18pF +/-30ppm Surface Mount Crystal [Digikey: 535-9857-1-ND] 12.0 MHz Surface Mount Crystal [Digikey: 535-9869-6-ND] 25.0 MHz Surface Mount Crystal [Digikey: 535-9078-1-ND] 2.5 x 2.0mm - MEMs SMT Crystal 16.0 MHz 10pF 20ppm 2.5 x 2.0mm Crystal [Digikey -40-85°C: 535-10923-1-ND] 3.2 x 2.5mm - MEMs SMT Crystal 12.0 MHz 8pF 15ppm 3.2 x 2.5mm Crystal [Digikey: -10-70°C: 644-1047-1-ND -40-125°C: 644-1128-1-ND] 16.0 MHz 8pF 15ppm 3.2 x 2.5mm Crystal [Digikey: -10-70°C: 644-1049-1-ND -40-125°C: 644-1129-2-ND] 16.0 MHz 10pF 10ppm 3.2 x 2.5mm Crystal [Digikey: 644-1100-1-ND] 27.12 MHz 18pF 30ppm 3.2 x 2.5mm Crystal [Digikey: 887-1424-1-ND] 27.12MHz 10pF 10ppm 3.2 x 2.5mm Crystal [Digikey: 887-1329-1-ND] 4.9 x 1.8mm - MEMs SMT Crystal 32.768 KHz 12.5pF 20ppm 4.9 x 1.8mm Crystal [Digikey: SE2415CT-ND] 8.0 x 3.8mm - Surface Mount Crystal 32.768kHz 12.5pF 20ppm -40°C-85°C [Digikey: 535-9166-2-ND] Cylinder 32.768KHz Cylinder Crystal (2x6mm body) [Ex. Digikey: 300-8341-2-ND]

## Board
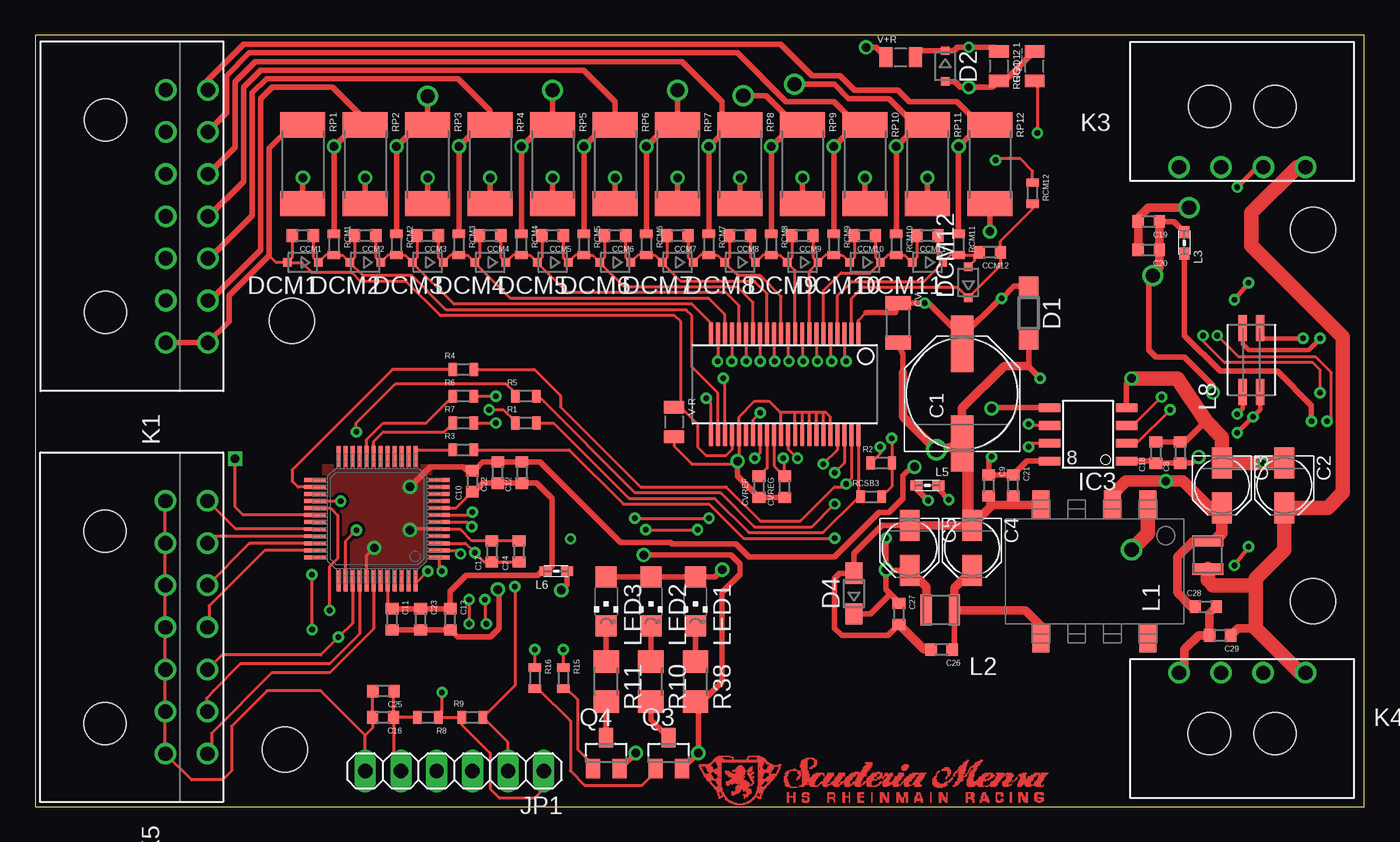
[diagram p6: board, top side]
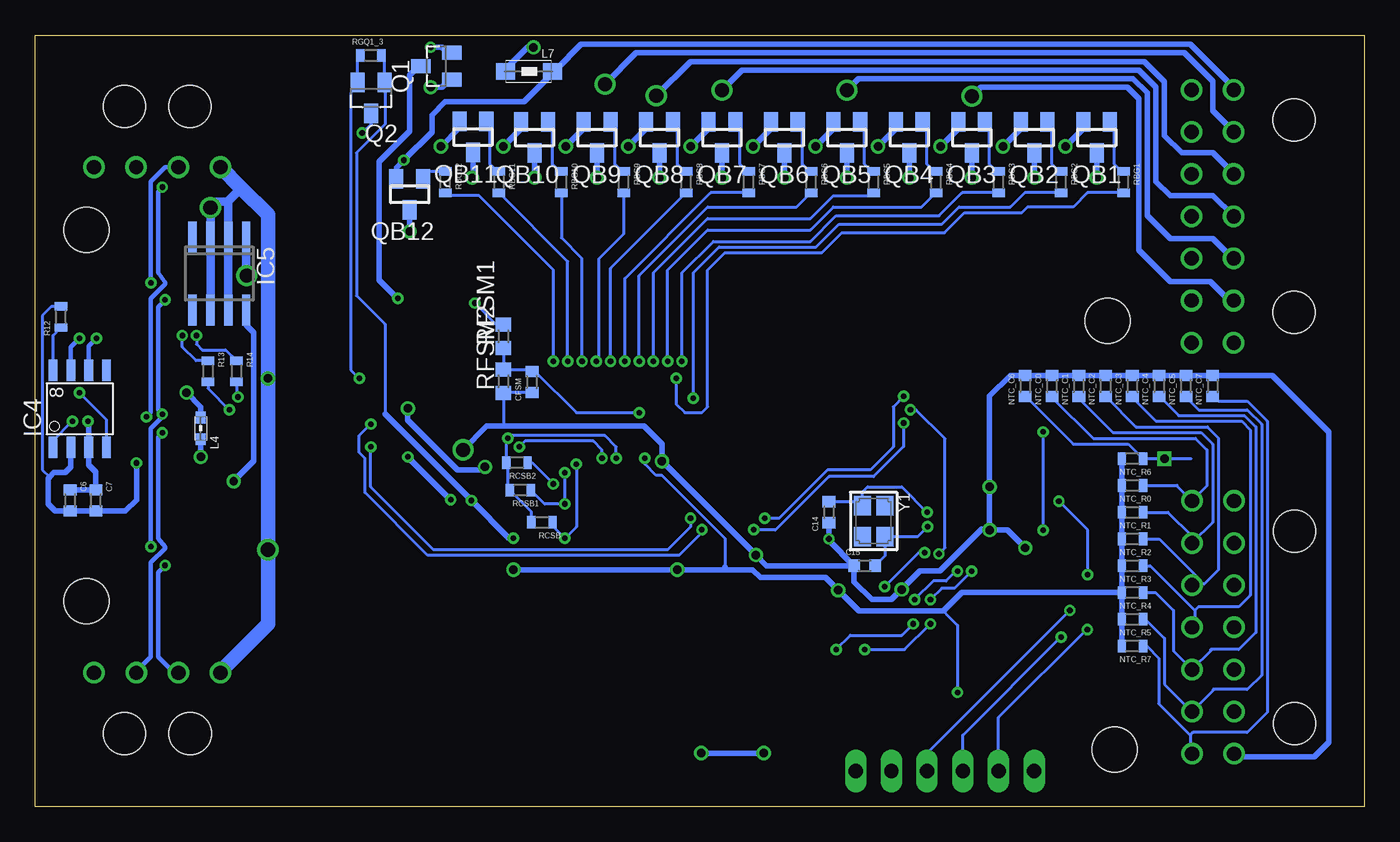
[diagram p7: board, bottom side, seen from below]

Size 94.59 x 54.91 mm. Coordinates in mm from the lower left corner, seen from the top.
Outline: 0,0 94.59,0 94.59,54.91 0,54.91 0,0
Copper layers (1*16): Top 0.035mm / dielectric 1.5mm / Bottom 0.035mm
Design rules "default *": minimum track width 6mil, minimum drill 0.3mm, track to track 8mil, track to pad 8mil, pad to pad 8mil, via to via 8mil, smd to smd 8mil, copper to edge 12mil, drill to drill 8mil, minimum pad ring 10mil, minimum via ring 8mil, stop-mask expansion 4mil, vias tented up to drill 0mil, thermal gap 10mil
Holes 3.2 mm at 18.28,34.57 17.78,4.06 90.93,41.05 90.93,14.63
tRestrict: area 15.3,31.6 to 21.3,37.6; area 14.8,1.1 to 20.8,7.1; area 87.9,38 to 93.9,44; area 87.9,11.6 to 93.9,17.6
bRestrict: area 15.3,31.6 to 21.3,37.6; area 14.8,1.1 to 20.8,7.1; area 87.9,38 to 93.9,44; area 87.9,11.6 to 93.9,17.6

### Footprints (pad centres in the part's own frame; a part is rotated, then mirrored left to right if it is on the bottom)
PANASONIC_F = smd 4 x 1.6: + 3.55,0; - -3.55,0
PANASONIC_B = smd 2.2 x 1.4: + 1.6,0; - -1.6,0
C0603 = smd 0.8 x 0.9: 1 -0.75,0; 2 0.75,0
C1206 = smd 1 x 1.8: 1 -1.4,0; 2 1.4,0
SOD123 = smd 1.4 x 1.4: A 1.9,0; C -1.9,0
SOD323-R = smd 0.6 x 0.6: A 1.1,0; C -1.1,0
SOD323-W = smd 1.5 x 1.2: A 1.45,0; C -1.45,0
ISF = smd 1.2 x 2: 1 -3.81,-4.75; 2 -1.27,-4.75; 4 3.81,-4.75; 5 3.81,4.75; 8 -3.81,4.75
LQFP48 = smd 0.28 x 1.5: 1 -2.75,-4.425; 2 -2.25,-4.425; 3 -1.75,-4.425; 4 -1.25,-4.425; 5 -0.75,-4.425; 6 -0.25,-4.425; 7 0.25,-4.425; 8 0.75,-4.425; 9 1.25,-4.425; 10 1.75,-4.425; 11 2.25,-4.425; 12 2.75,-4.425; 25 2.75,4.425; 26 2.25,4.425; 27 1.75,4.425; 28 1.25,4.425; 29 0.75,4.425; 30 0.25,4.425; 31 -0.25,4.425; 32 -0.75,4.425; 33 -1.25,4.425; 34 -1.75,4.425; 35 -2.25,4.425; 36 -2.75,4.425 | smd 1.5 x 0.28: 13 4.425,-2.75; 14 4.425,-2.25; 15 4.425,-1.75; 16 4.425,-1.25; 17 4.425,-0.75; 18 4.425,-0.25; 19 4.425,0.25; 20 4.425,0.75; 21 4.425,1.25; 22 4.425,1.75; 23 4.425,2.25; 24 4.425,2.75; 37 -4.425,2.75; 38 -4.425,2.25; 39 -4.425,1.75; 40 -4.425,1.25; 41 -4.425,0.75; 42 -4.425,0.25; 43 -4.425,-0.25; 44 -4.425,-0.75; 45 -4.425,-1.25; 46 -4.425,-1.75; 47 -4.425,-2.25; 48 -4.425,-2.75
44SSOP = smd 1.6 x 0.28: 1 -3.6,5.25; 2 -3.6,4.75; 3 -3.6,4.25; 4 -3.6,3.75; 5 -3.6,3.25; 6 -3.6,2.75; 7 -3.6,2.25; 8 -3.6,1.75; 9 -3.6,1.25; 10 -3.6,0.75; 11 -3.6,0.25; 12 -3.6,-0.25; 13 -3.6,-0.75; 14 -3.6,-1.25; 15 -3.6,-1.75; 16 -3.6,-2.25; 17 -3.6,-2.75; 18 -3.6,-3.25; 19 -3.6,-3.75; 20 -3.6,-4.25; 21 -3.6,-4.75; 22 -3.6,-5.25; 23 3.6,-5.25; 24 3.6,-4.75; 25 3.6,-4.25; 26 3.6,-3.75; 27 3.6,-3.25; 28 3.6,-2.75; 29 3.6,-2.25; 30 3.6,-1.75; 31 3.6,-1.25; 32 3.6,-0.75; 33 3.6,-0.25; 34 3.6,0.25; 35 3.6,0.75; 36 3.6,1.25; 37 3.6,1.75; 38 3.6,2.25; 39 3.6,2.75; 40 3.6,3.25; 41 3.6,3.75; 42 3.6,4.25; 43 3.6,4.75; 44 3.6,5.25
SO-8 = smd 1.524 x 0.61: 1 -2.743,1.905; 2 -2.743,0.635; 3 -2.743,-0.635; 4 -2.743,-1.905; 5 2.743,-1.905; 6 2.743,-0.635; 7 2.743,0.635; 8 2.743,1.905
SO08 = smd 0.6 x 2.2: 1 -1.905,-2.6; 2 -0.635,-2.6; 3 0.635,-2.6; 4 1.905,-2.6; 5 1.905,2.6; 6 0.635,2.6; 7 -0.635,2.6; 8 -1.905,2.6
1X06 = drill 1.016 long: 1 -6.35,0; 2 -3.81,0; 3 -1.27,0; 4 1.27,0; 5 3.81,0; 6 6.35,0
66201421022 = drill 1.02: 1 0,-1.5; 2 -3,-1.5; 3 -6,-1.5; 4 -9,-1.5; 5 -12,-1.5; 6 -15,-1.5; 7 -18,-1.5; 8 0,1.5; 9 -3,1.5; 10 -6,1.5; 11 -9,1.5; 12 -12,1.5; 13 -15,1.5; 14 -18,1.5 | hole 3: -2.15,-5.8; -15.85,-5.8
66200411022 = drill 1.02: 1 1.5,0; 2 -1.5,0; 3 -4.5,0; 4 -7.5,0 | hole 3: -0.66,-4.32; -5.34,-4.32
WE-PMI_1008 = smd 0.8 x 2.2: 1 -1,0; 2 1,0
0603 = smd 0.85 x 0.7: 1 -0.775,0; 2 0.775,0
1206 = smd 1.35 x 1.2: 1 -1.675,0; 2 1.675,0
WE-SLM = smd 1.85 x 0.6: 1 -2.28,0.63; 2 -2.28,-0.62; 3 2.27,-0.62; 4 2.27,0.63
CHIPLED_1206 = smd 1.5 x 1.5: A 0,-1.75; C 0,1.75
R0603 = smd 0.6 x 0.9: 1 -0.75,0; 2 0.75,0
SOT23 = smd 1 x 1.4: 1 -0.95,-1.1; 2 0.95,-1.1; 3 0,1.1
SUPER-SOT3 = smd 1 x 1.4: 1 -0.95,-1.1; 2 0.95,-1.1; 3 0,1.1
R1206 = smd 1.6 x 1.803: 1 -1.422,0; 2 1.422,0
R0603' = smd 1 x 1.1: 1 -0.85,0; 2 0.85,0
R0805 = smd 0.9 x 1.4: 1 -1.05,0; 2 1.05,0
R2512 = smd 1.8 x 3.2: 1 -2.8,0; 2 2.8,0
CRYSTAL_3.2X2.5 = smd 1.4 x 1.2: 1 -1.1,-0.8; 2 1.1,0.8; GND1 -1.1,0.8; GND2 1.1,-0.8

### Placement (x,y rotation side)
C1  65.96,29.39 90 top
C2  88.9,22.86 270 top
C3  84.45,22.86 270 top
C4  66.67,18.41 270 top
C5  62.23,18.41 270 top
C6  92.1,21.79 270 bottom
C7  90.27,21.79 270 bottom
C8  81.48,25.2 90 top
C9  67.87,22.86 270 top
C10  31.11,23.16 90 top
C11  25.4,13.34 270 top
C12  34.65,23.77 90 top
C13  29.54,13.34 270 top
C14  38.1,20.95 90 bottom
C15  35.56,17.14 0 bottom
C16  24.77,6.35 180 top
C17  32.51,18.16 90 top
C18  79.76,25.2 90 top
C19  79.25,41.66 180 top
C20  79.25,39.62 180 top
C21  69.6,22.86 270 top
C22  32.92,23.77 90 top
C23  27.43,13.34 270 top
C24  34.44,18.16 90 top
C25  24.79,8.23 180 top
C26  64.52,11.18 180 top
C27  61.47,13.72 270 top
C28  83.31,14.22 0 top
C29  84.33,12.19 180 top
CCM1  19.05,40.64 180 top
CCM2  23.5,40.64 180 top
CCM3  27.94,40.64 180 top
CCM4  32.38,40.64 180 top
CCM5  36.83,40.64 180 top
CCM6  41.27,40.64 180 top
CCM7  45.72,40.64 180 top
CCM8  50.16,40.64 180 top
CCM9  54.61,40.64 180 top
CCM10  59.05,40.64 180 top
CCM11  63.5,40.64 180 top
CCM12  67.94,39.46 180 top
CFSM  59.23,30.23 90 bottom
CV  61.42,34.44 270 top
CVREF  51.51,22.76 90 top
CVREG  53.34,22.76 90 top
D1  70.71,35.14 270 top
D2  64.77,52.7 270 top
D4  58.27,15.16 90 top
DCDC1  75.39,16.74 180 top
DCM1  19.05,38.73 180 top
DCM2  23.5,38.73 180 top
DCM3  27.94,38.73 180 top
DCM4  32.38,38.73 180 top
DCM5  36.83,38.73 180 top
DCM6  41.27,38.73 180 top
DCM7  45.72,38.73 180 top
DCM8  50.16,38.73 180 top
DCM9  54.61,38.73 180 top
DCM10  59.05,38.73 180 top
DCM11  63.5,38.73 180 top
DCM12  66.41,37.31 90 top
IC1  24.33,20.5 90 top
IC2  53.34,30.06 270 top
IC3  74.93,26.49 180 top
IC4  91.41,28.32 90 bottom
IC5  81.48,37.95 180 bottom
JP1  29.84,2.54 180 top
K1  10.79,33.02 270 top
K3  82.91,45.52 180 top
K4  88.9,9.53 0 top
K5  10.77,3.76 270 top
L1  83.44,17.91 90 top
L2  64.41,14 180 top
L3  81.79,40.13 90 top
L4  82.8,26.92 90 bottom
L5  63.5,22.86 180 top
L6  37.08,16.76 0 top
L7  59.44,52.32 180 bottom
L8  86.56,31.8 90 top
LED1  46.99,14.61 180 top
LED2  43.81,14.61 180 top
LED3  40.64,14.61 180 top
NTC_C0  22.23,29.93 90 bottom
NTC_C1  20.32,29.93 90 bottom
NTC_C2  18.41,29.93 90 bottom
NTC_C3  16.51,29.93 90 bottom
NTC_C4  14.61,29.93 90 bottom
NTC_C5  12.7,29.93 90 bottom
NTC_C6  24.13,29.93 90 bottom
NTC_C7  10.79,29.93 90 bottom
NTC_R0  16.51,22.86 180 bottom
NTC_R1  16.51,20.95 180 bottom
NTC_R2  16.51,19.05 180 bottom
NTC_R3  16.51,17.14 180 bottom
NTC_R4  16.51,15.24 180 bottom
NTC_R5  16.51,13.34 180 bottom
NTC_R6  16.51,24.77 180 bottom
NTC_R7  16.51,11.43 180 bottom
Q1  66.04,52.7 90 bottom
Q2  70.69,50.44 180 bottom
Q3  45.09,3.81 0 top
Q4  40.64,3.81 0 top
QB1  19.05,47.62 180 bottom
QB2  23.5,47.62 180 bottom
QB3  27.94,47.62 180 bottom
QB4  32.38,47.62 180 bottom
QB5  36.83,47.62 180 bottom
QB6  41.27,47.62 180 bottom
QB7  45.72,47.62 180 bottom
QB8  50.16,47.62 180 bottom
QB9  54.61,47.62 180 bottom
QB10  59.05,47.62 180 bottom
QB11  63.44,47.66 180 bottom
QB12  67.94,43.59 180 bottom
R1  34.92,27.3 0 top
R2  60.22,24.46 0 top
R3  30.48,25.4 0 top
R4  30.48,31.11 0 top
R5  34.92,29.21 0 top
R6  30.48,29.21 0 top
R7  30.48,27.3 0 top
R8  27.94,6.35 180 top
R9  31.11,6.35 0 top
R10  43.81,8.89 270 top
R11  40.64,8.89 270 top
R12  92.76,34.85 90 bottom
R13  82.3,30.99 270 bottom
R14  80.26,30.99 270 bottom
R15  37.59,9.14 270 top
R16  35.56,9.14 270 top
R38  46.99,8.89 270 top
RBG1  17.14,44.45 270 bottom
RBG2  21.59,44.45 270 bottom
RBG3  26.04,44.45 270 bottom
RBG4  30.48,44.45 270 bottom
RBG5  34.92,44.45 270 bottom
RBG6  39.37,44.45 270 bottom
RBG7  43.81,44.45 270 bottom
RBG8  48.26,44.45 270 bottom
RBG9  52.7,44.45 270 bottom
RBG10  57.15,44.45 270 bottom
RBG11  61.59,44.45 270 bottom
RBG12  65.41,44.45 270 bottom
RCM1  21.27,40.01 270 top
RCM2  25.72,40.01 270 top
RCM3  30.16,40.01 270 top
RCM4  34.61,40.01 270 top
RCM5  39.05,40.01 270 top
RCM6  43.5,40.01 270 top
RCM7  47.94,40.01 270 top
RCM8  52.39,40.01 270 top
RCM9  56.83,40.01 270 top
RCM10  61.28,40.01 270 top
RCM11  65.72,40.01 270 top
RCM12  70.98,43.66 270 top
RCSB  58.52,20.24 180 bottom
RCSB1  60.07,22.53 180 bottom
RCSB2  60.3,24.49 180 bottom
RCSB3  59.49,22.05 0 top
RFSM1  332k0.1%  [R0603']  61.26,33.48 90 bottom
RFSM2  20k0.1%  [R0603']  61.26,30.28 90 bottom
RGQ1_1  68.58,52.7 270 top
RGQ1_2  71.12,52.7 90 top
RGQ1_3  70.71,53.47 0 bottom
RP1  19.05,45.72 270 top
RP2  23.5,45.72 270 top
RP3  27.94,45.72 270 top
RP4  32.38,45.72 270 top
RP5  36.83,45.72 270 top
RP6  41.27,45.72 270 top
RP7  45.72,45.72 270 top
RP8  50.16,45.72 270 top
RP9  54.61,45.72 270 top
RP10  59.05,45.72 270 top
RP11  63.5,45.72 270 top
RP12  67.94,45.72 270 top
U$15  [SMLOGOS]  50.19,1.83 0 top
V+R  61.59,53.34 0 top
V-R  45.47,27.38 270 top
Y1  34.92,20.32 270 bottom

### Tracks (layer width: path | path; a pad name or v marks a point on that pad's centre or on a via)
!RESET  (via drill 0.4)
  Top 0.203: JP1.2 33.66,4.56 R9.2 34.14,8.62 v34.14,15.65 | IC1.3 30.63,18.75 v31.29,18.09 31.97,17.41 C17.1 C24.1
  Bottom 0.203: v31.29,18.09 31.7,18.09 v34.14,15.65
+3V3  (via drill 0.4, 0.6)
  Top 0.203: JP1.1 36.2,1.27 35.56,0.64 33.02,0.64 32.38,1.27 32.38,3.81 30.36,5.83 R9.1 R8.1 28.7,6.35 28.96,6.6 v28.96,8.13 | IC2.30 51.59,25.17 v51.21,24.79
  Top 0.406: C5.+ 60.6,16.82 v60.55,16.87 | v48.9,16.87 48.38,16.36 LED1.A LED2.A LED3.A | v60.55,19.1 v60.55,16.87 | 60.45,16.76 v60.55,16.87 | L6.2 37.86,15.81 v37.44,15.39 | C27.1 61.47,14.53 60.86,15.14 | 60.86,15.14 60.55,15.44 v60.55,16.87 | L5.2 62.73,22.62 v63.55,21.79 | D4.C 59.43,13.71 60.86,15.14
  Top 0.61: L2.2 63.41,15.63 C5.+
  Bottom 0.203: RGQ1_3.2 69.74,53.24 Q2.1 69.74,51.17 69.7,51.21 69.7,48.56 71.73,46.53 71.73,36.37 69.7,34.34 69.7,27.94 | v51.21,24.79 51.21,24.38 50.39,23.57 49.99,23.57 45.52,19.1 45.52,17.07 | 29.95,13.92 29.64,13.59 28.96,12.9 v28.96,8.13
  Bottom 0.406: NTC_R6.2 NTC_R0.2 NTC_R1.2 NTC_R2.2 NTC_R3.2 NTC_R4.2 | NTC_R7.2 NTC_R5.2 NTC_R4.2 | NTC_R4.2 28.63,15.24 29.95,13.92 35.97,13.92 v37.44,15.39 38.35,16.31 42.98,16.31 43.54,16.87 45.52,16.87 | v60.55,16.87 v48.9,16.87 45.52,16.87 | 45.52,17.07 45.52,16.87 | v60.55,19.1 60.86,19.1 v63.55,21.79 69.7,27.94
+3V3_AD  (via drill 0.4)
  Top 0.406: L5.1 64.28,22.59 v65.02,21.84 | IC3.8 70.57,24.59 C21.1 C9.1 67.87,24.69 v68.07,24.89
  Bottom 0.406: v65.02,21.84 v68.07,24.89
+3V3_UC
  Top 0.203: IC1.44 25.08,14.4 C11.1 | IC1.8 29.95,21.25 C10.1
  Top 0.406: C11.1 C23.1 C13.1 29.54,15.32 30.68,16.46 35.76,16.46 36.07,16.76 L6.1 36.78,17.11 36.78,21.95 35.7,23.02 C12.1 C22.1 31.86,23.02 31.29,22.45 C10.1
+3V3DCOUT
  Top 0.406: 65.41,15.55 65.41,11.32 C26.1
  Top 0.61: C4.+ 65.41,15.55 L2.1 65.44,13.97 70.48,13.97 71.58,12.88 DCDC1.5
ACTIVE_LED  (via drill 0.4)
  Top 0.203: IC1.48 27.25,16.07 v27.94,16.76 | v30.89,14.73 v30.89,13.01 | R16.1 v35.56,11.18
  Bottom 0.203: v27.94,16.76 29.16,15.54 30.07,15.54 v30.89,14.73 | v35.56,11.18 32.72,11.18 v30.89,13.01
ACTIVE_LED_G
  Top 0.203: R16.2 35.8,8.39 38.1,6.1 38.1,2.54 39.12,1.52 43.18,1.52 44.13,2.48 Q3.1
AD0
  Top 0.203: IC1.32 14.28,19.75 K5.14
  Bottom 0.203: NTC_C0.1 22.23,29.13 19.3,26.21 12.01,26.21 11.2,25.4 11.2,22.83 K5.14 13.35,22.84 13.35,22.86 NTC_R0.1
AD1
  Top 0.203: IC1.33 12.73,19.25 12.73,19.22 K5.13
  Bottom 0.203: NTC_C1.1 20.32,29.06 17.88,26.62 11.61,26.62 10.79,25.81 10.79,20.23 K5.13 12.29,18.79 12.29,19.28 13.97,20.95 NTC_R1.1
AD2
  Top 0.203: IC1.34 15.23,18.75 15.23,18.72 K5.12
  Bottom 0.203: NTC_C2.1 16.26,27.03 11.18,27.03 10.39,26.24 10.39,16.87 11.4,15.85 12.26,15.85 | NTC_R2.1 14.61,19.05 12.06,16.51 12.06,16.26 | 12.06,16.26 12.06,16.04 | 12.26,15.85 12.26,16.07 12.06,16.26 | 12.26,15.85 12.26,15.77 K5.12
AD3
  Top 0.203: IC1.35 16.34,18.25 12.38,14.29 12.38,12.9 12.27,12.79 K5.11
  Bottom 0.203: NTC_C3.1 16.51,29.11 14.83,27.43 8.74,27.43 8.13,26.82 8.13,15.04 8.94,14.22 11.81,14.22 12.06,13.97 | NTC_R3.1 15.24,17.14 12.06,13.97 | 12.06,13.97 12.06,12.96 K5.11
AD4/SWDIO  (via drill 0.4)
  Top 0.203: IC1.39 22.58,13.06 v21.59,12.06 20.32,10.79 13.28,10.79 13.28,10.77 K5.10
  Bottom 0.203: NTC_C4.1 14.55,29.18 13.21,27.84 8.53,27.84 7.72,27.03 7.72,12.39 8.94,11.18 10.93,11.18 10.93,11.1 K5.10 13.59,11.08 13.59,13.97 14.86,15.24 NTC_R4.1 | JP1.4 28.57,5.08 v21.59,12.06
AD5
  Top 0.203: IC1.40 23.08,12.29 20.95,10.16 14.61,10.16 12.7,8.26 12.7,8.23 12.19,7.72 12.19,6.91 12.27,6.83 K5.9
  Bottom 0.203: NTC_C5.1 12.7,29.16 11.79,28.25 8.33,28.25 7.32,27.23 7.32,9.35 8.33,8.33 10.77,8.33 10.77,8.26 K5.9 14.22,8.71 14.22,11.99 15.57,13.34 NTC_R5.1
AD6  (via drill 0.6)
  Top 0.203: IC1.30 14.81,20.75 14.22,21.34 v14.22,24.77
  Bottom 0.203: 12.34,24.77 v14.22,24.77 NTC_R6.1 16.8,25.81 20.73,25.81 24.1,29.18 NTC_C6.1
AD7
  Top 0.203: IC1.42 24.08,12.65 20.95,9.53 16.84,9.53 12.55,5.23 12.55,4.06 12.55,4.04 K5.8
  Bottom 0.203: NTC_C7.1 10.69,29.18 10.36,28.85 8.33,28.85 6.91,27.43 6.91,6.71 8.33,5.28 12.19,5.28 12.39,5.08 | NTC_R7.1 15.49,11.43 14.63,10.57 14.63,7.32 12.39,5.08 | 12.39,5.08 12.39,3.88 K5.8
BAL1  (via drill 0.4)
  Top 0.203: IC2.25 49.09,30.36 v48.97,30.48
  Bottom 0.203: v48.97,30.48 48.97,28.65 48.36,28.04 47.14,28.04 46.74,28.45 46.74,38.2 45.52,39.42 38.61,39.42 37.19,40.84 29.87,40.84 28.45,42.27 24.38,42.27 23.98,42.67 20.73,42.67 19.7,43.7 RBG1.2
BAL2  (via drill 0.4)
  Top 0.203: IC2.23 48.09,28.72 v47.75,29.06
  Bottom 0.203: v47.75,29.06 47.75,38 45.92,39.83 39.01,39.83 37.39,41.45 30.07,41.45 28.85,42.67 25.2,42.67 24.17,43.7 RBG2.2
BAL3  (via drill 0.4)
  Top 0.203: IC2.21 48.59,31.72 v48.56,31.7
  Bottom 0.203: v48.56,31.7 48.56,38 46.33,40.23 39.42,40.23 37.59,42.06 30.28,42.06 28.64,43.7 RBG3.2
BAL4  (via drill 0.4)
  Top 0.203: IC2.19 v49.59,31.71 v49.58,31.7
  Bottom 0.203: v49.58,31.7 49.58,38.2 46.74,41.05 39.42,41.05 37.8,42.67 31.51,42.67 RBG4.2
BAL5  (via drill 0.4)
  Top 0.203: IC2.17 v50.59,31.71 v50.6,31.7
  Bottom 0.203: v50.6,31.7 50.6,38 46.74,41.86 39.42,41.86 37.8,43.48 35.14,43.48 RBG5.2
BAL6  (via drill 0.4)
  Top 0.203: IC2.15 51.59,31.72 v51.61,31.7
  Bottom 0.203: v51.61,31.7 51.61,37.8 46.74,42.67 40.4,42.67 RBG6.2
BAL7  (via drill 0.4)
  Top 0.203: IC2.13 52.59,31.74 v52.63,31.7
  Bottom 0.203: v52.63,31.7 52.63,37.59 46.52,43.7 RBG7.2
BAL8  (via drill 0.4)
  Top 0.203: IC2.11 53.59,31.75 v53.65,31.7
  Bottom 0.203: v53.65,31.7 53.65,38.31 RBG8.2
BAL9  (via drill 0.4)
  Top 0.203: IC2.9 54.59,31.77 v54.66,31.7
  Bottom 0.203: v54.66,31.7 54.46,31.9 54.46,39.01 52.7,40.77 RBG9.2
BAL10  (via drill 0.4)
  Top 0.203: IC2.7 55.59,31.79 v55.68,31.7
  Bottom 0.203: v55.68,31.7 55.68,39.01 57.15,40.49 RBG10.2
BAL11  (via drill 0.4)
  Top 0.203: IC2.5 56.59,31.8 v56.69,31.7
  Bottom 0.203: v56.69,31.7 56.69,38.8 RBG11.2
BAL12  (via drill 0.4)
  Top 0.203: IC2.3 57.59,31.82 v57.71,31.7
  Bottom 0.203: v57.71,31.7 57.71,38.2 62.99,43.48 65.19,43.48 RBG12.2
C0
  Top 0.203: IC2.26 49.59,25.41 49.17,24.99 47.75,24.99 47.14,25.6 47.14,27.23 45.94,28.43 V-R.1 45.7,28.43 45.92,28.65 45.92,34.54 45.52,34.95 28.85,34.95 26.42,37.39 23.16,37.39 22.55,38 19.71,38 18.97,38.73 DCM1.A | DCM1.A 17.14,38.73 16.66,39.22 | CCM1.2 18.3,39.09 DCM1.A
  Top 0.406: K1.8 | RP1.1 18.32,48.52 16.66,46.86 16.66,39.22 13.82,36.37 13.82,34.54 K1.8 | K1.8 K1.1
C1  (via drill 0.6)
  Top 0.406: RCM1.1 v21.27,46.99 22.8,48.52 RP2.1 23.5,48.9 21.18,51.21 16.87,51.21 16.05,50.39 16.05,39.62 12.45,36.02 K1.9
  Bottom 0.406: QB1.2 20,48.26 v21.27,46.99
C1M
  Top 0.203: IC2.24 48.59,29.44 46.74,31.29 46.74,34.95 46.33,35.36 29.26,35.36 26.82,37.8 23.34,37.8 DCM2.A | CCM1.1 19.8,39.09 DCM1.C 20.67,39.26 RCM1.2 21.88,39.26 DCM2.A | CCM2.2 22.75,39.09 DCM2.A
C2  (via drill 0.6, 1)
  Top 0.406: RCM2.1 v25.72,46.99 27.25,48.52 RP3.1 v27.94,50.57
  Bottom 0.406: K1.2 9.6,36.02 10.97,37.39 13.82,37.39 16.05,39.62 16.05,50.39 16.87,51.21 27.3,51.21 v27.94,50.57 | QB2.2 24.45,48.26 v25.72,46.99
C2M
  Top 0.203: IC2.22 48.09,34.41 46.74,35.76 29.81,35.76 DCM3.A | CCM2.1 24.25,39.09 DCM2.C 25.11,39.26 RCM2.2 26.32,39.26 DCM3.A | CCM3.2 27.19,39.09 DCM3.A
C3  (via drill 0.6)
  Top 0.406: RCM3.1 v30.16,46.99 31.69,48.52 RP4.1 32.38,49.53 30.1,51.82 16.46,51.82 15.44,50.8 15.44,42.06 12.4,39.02 K1.10
  Bottom 0.406: QB3.2 28.89,48.26 v30.16,46.99
C3M
  Top 0.203: IC2.20 49.09,35.03 47.95,36.17 33.85,36.17 DCM4.A | CCM3.1 28.69,39.09 DCM3.C 29.56,39.26 RCM3.2 30.77,39.26 DCM4.A | CCM4.2 31.64,39.09 DCM4.A
C4  (via drill 0.6, 1)
  Top 0.406: RCM4.1 v34.61,46.99 36.14,48.52 RP5.1 v36.83,51
  Bottom 0.406: K1.3 9.35,39.02 10.77,40.44 13.82,40.44 15.44,42.06 15.44,50.8 16.46,51.82 36.02,51.82 v36.83,51 | QB4.2 33.34,48.26 v34.61,46.99
C4M
  Top 0.203: IC2.18 50.09,35.66 49.17,36.58 37.89,36.58 DCM5.A | CCM4.1 33.13,39.09 DCM4.C 34.01,39.26 RCM4.2 35.21,39.26 DCM5.A | CCM5.2 36.08,39.09 DCM5.A
C5  (via drill 0.6)
  Top 0.406: RCM5.1 v39.05,46.99 40.58,48.52 | RP6.1 40.58,48.52 | K1.11 12.35,42.02 14.83,44.5 14.83,51.21 16.05,52.43 39.01,52.43 41.27,50.16 41.27,49.21 40.58,48.52
  Bottom 0.406: QB5.2 37.78,48.26 v39.05,46.99
C5M
  Top 0.203: IC2.16 51.09,35.88 49.99,36.98 41.93,36.98 DCM6.A | CCM5.1 37.58,39.09 DCM5.C 38.45,39.26 RCM5.2 39.66,39.26 DCM6.A | CCM6.2 40.52,39.09 DCM6.A
C6  (via drill 0.6, 1)
  Top 0.406: RCM6.1 v43.5,46.99 45.03,48.52 RP7.1 v45.72,51
  Bottom 0.406: K1.4 9.3,42.02 10.77,43.48 13.82,43.48 14.83,44.5 14.83,51.21 16.05,52.43 44.3,52.43 v45.72,51 | QB6.2 42.23,48.26 v43.5,46.99
C6M
  Top 0.203: IC2.14 52.09,36.51 51.21,37.39 45.97,37.39 DCM7.A | CCM6.1 42.02,39.09 DCM6.C 42.9,39.26 RCM6.2 44.1,39.26 DCM7.A | CCM7.2 44.97,39.09 DCM7.A
C7  (via drill 0.6)
  Top 0.406: RCM7.1 v47.94,46.99 49.37,48.42 | 50.16,49.21 50.01,49.05 | 50.01,49.05 49.37,48.42 | K1.12 12.3,45.02 14.22,46.94 14.22,51.61 15.65,53.03 46.02,53.03 48.9,50.16 48.9,48.9 49.37,48.42 | RP8.1 50.16,48.9 50.01,49.05
  Bottom 0.406: QB7.2 46.67,48.26 v47.94,46.99
C7M
  Top 0.203: IC2.12 53.09,36.32 51.61,37.8 50.01,37.8 DCM8.A | CCM7.1 46.47,39.09 DCM7.C 47.34,39.26 RCM7.2 48.55,39.26 DCM8.A | CCM8.2 49.41,39.09 DCM8.A
C8  (via drill 0.6, 1)
  Top 0.406: RCM8.1 v52.39,46.99 53.92,48.52 | RP9.1 53.92,48.52 | v50.39,50.6 52.02,50.6 53.92,48.7 53.92,48.52
  Bottom 0.406: K1.5 9.29,45.06 10.77,46.53 13.01,46.53 14.22,47.75 14.22,51.61 15.65,53.03 47.95,53.03 v50.39,50.6 | QB8.2 51.12,48.26 v52.39,46.99
C8M
  Top 0.203: IC2.10 54.09,38.16 DCM9.A | DCM9.A 52.99,39.26 RCM8.2 51.78,39.26 DCM8.C 50.91,39.09 CCM8.1 | CCM9.2 53.86,39.09 DCM9.A
C9  (via drill 0.6)
  Top 0.406: RCM9.1 v56.83,46.99 58.36,48.52 58.52,48.52 | RP10.1 58.52,48.52 | K1.13 12.29,48.06 13.61,49.38 13.61,52.02 15.24,53.65 49.99,53.65 53.44,50.19 56.85,50.19 58.52,48.52
  Bottom 0.406: QB9.2 55.56,48.26 v56.83,46.99
C9M
  Top 0.203: IC2.8 55.09,38.12 DCM9.C | CCM9.1 55.36,39.09 DCM9.C | DCM9.C 56.23,39.26 RCM9.2 57.44,39.26 DCM10.A 58.3,39.09 CCM10.2
C10  (via drill 0.6, 1)
  Top 0.406: RCM10.1 v61.28,46.99 62.81,48.52 | RP11.1 62.81,48.52 | 62.81,48.52 62.63,48.52 60.76,50.39 57.89,50.39 56.87,51.41 v54.05,51.41
  Bottom 0.406: K1.6 10.79,49.53 10.79,51.64 12.8,53.65 51.82,53.65 v54.05,51.41 | QB10.2 60.01,48.26 v61.28,46.99
C10M
  Top 0.203: IC2.6 56.09,36.72 57.35,37.99 59.41,37.99 DCM10.C | CCM10.1 59.8,39.09 DCM10.C | DCM10.C 60.67,39.26 RCM10.2 61.88,39.26 DCM11.A 62.75,39.09 CCM11.2
C11  (via drill 0.6)
  Top 0.406: RCM11.1 v65.72,46.99 67.25,48.52 | RP12.1 67.25,48.52 | K1.14 12.29,51.72 14.83,54.25 53.03,54.25 55.27,52.02 57.28,52.02 58.29,51 61.39,51 62.23,50.16 65.61,50.16 67.25,48.52
  Bottom 0.406: QB11.2 64.39,48.33 v65.72,46.99
C11M
  Top 0.203: IC2.4 57.09,36.36 58.12,37.39 63.25,37.39 DCM11.C | CCM11.1 64.25,39.09 DCM11.C | DCM11.C 65.12,39.26 RCM11.2 66.89,39.26 | CCM12.2 66.99,39.26 66.89,39.26 | 66.89,39.26 66.85,39.22 66.85,38.86 DCM12.A
C12  (via drill 0.4)
  Top 0.203: RCM12.1 70.98,45.25 70.1,46.13 68.48,46.13 v68.36,46.01
  Bottom 0.406: K1.7 9.16,51.02 12.39,54.25 55.73,54.25 57.53,52.45 | 57.53,52.45 57.76,52.22 | QB12.2 68.89,44.29 68.89,45.49 v68.36,46.01 66.36,48.02 66.36,49.21 65.41,50.16 59.82,50.16 57.78,52.2 57.76,52.22 | 57.66,52.58 57.53,52.45 | L7.1 57.76,52.22
C12F  (via drill 0.6)
  Top 0.406: v59.13,54.05 59.83,54.05 V+R.1
  Bottom 0.406: v59.13,54.05 59.54,54.05 61.11,52.48 L7.2
C12M
  Top 0.203: IC2.2 58.09,36.14 58.93,36.98 65.64,36.98 DCM12.C 66.65,36.45 66.65,36.47 68.69,38.52 CCM12.1 68.69,40.25 70.98,42.53 RCM12.2
CANH  (via drill 0.4)
  Top 0.305: v85.34,17.17 v86.36,18.49 | v85.34,36.07 v86.36,37.29 | L8.1 85.93,28.33 v85.55,27.94
  Bottom 0.305: K4.3 84.71,9.53 85.85,10.67 85.85,16.66 v85.34,17.17 | v86.36,18.49 86.36,26.92 85.55,27.74 v85.55,27.94 85.85,28.25 85.85,35.56 v85.34,36.07 | v86.36,37.29 86.36,44.5 85.34,45.52 K3.2
CANHC  (via drill 0.4)
  Top 0.305: L8.4 85.93,32.94 86.36,32.51 90.63,32.51 v91.44,33.33
  Bottom 0.305: IC4.7 92.05,32.72 v91.44,33.33
CANL  (via drill 0.4)
  Top 0.305: K3.3 86.97,45.52 v85.55,44.09 | v85.55,26.62 v86.67,27.74 87.18,28.25 L8.2
  Bottom 0.305: K4.2 87.4,9.63 86.36,10.67 86.36,17.37 85.34,18.39 85.34,18.49 85.85,19.1 85.85,26.31 v85.55,26.62 | v85.55,44.09 85.85,43.79 85.85,38 85.34,37.29 85.34,37.19 86.36,36.17 86.36,28.04 v86.67,27.74
CANLC  (via drill 0.4)
  Top 0.305: v90.22,33.33 87.38,33.33 | 87.38,33.33 87.17,33.33 | L8.3 87.18,33.52 87.38,33.33
  Bottom 0.305: IC4.6 90.78,32.77 v90.22,33.33
CANRX  (via drill 0.4)
  Top 0.203: R7.2 v32.79,27.3 | v43.46,19.71 v47.14,19.71 | IC3.6 70.81,27.13 v70.71,27.23
  Bottom 0.203: v32.79,27.3 32.79,25.63 34.92,23.5 38.1,23.5 41.91,19.68 43.43,19.68 v43.46,19.71 | v47.14,19.71 47.14,19.51 48.77,17.88 66.65,17.88 71.12,22.35 71.12,24.79 71.53,25.2 71.53,26.42 v70.71,27.23
CANRX_U
  Top 0.203: IC1.19 24.08,25.99 24.77,26.67 29.09,26.67 R7.1
CANTX  (via drill 0.4)
  Top 0.203: R6.2 v32.79,29.21 | v42.67,20.52 v47.95,20.52 | IC3.7 70.97,25.86 v70.71,25.6
  Bottom 0.203: v32.79,29.21 32.79,29.18 33.53,28.45 33.53,25.6 35.15,23.98 38.2,23.98 41.66,20.52 v42.67,20.52 | v47.95,20.52 47.95,19.91 49.58,18.29 66.24,18.29 70.71,22.76 v70.71,25.6
CANTX_U
  Top 0.203: IC1.20 23.58,26.12 24.77,27.3 27.82,27.3 R6.1
CAR+5V  (via drill 0.6, 1)
  Top 0.406: v83.82,29.46 83.82,29.97 81.79,32 79.76,32 79.25,32.51 79.25,37.59 v79.55,37.8 | C19.1 81.04,41.66 L3.2
  Top 0.61: C19.1 C20.1 80,38.34 v79.55,37.8
  Bottom 0.406: L4.2 82.8,28.45 v83.82,29.46 | 79.58,37.92 v79.55,37.8
  Bottom 0.61: IC5.1 79.58,37.92
CAR+5V_AD  (via drill 0.6)
  Top 0.406: IC3.1 79.69,24.59 C18.1 C8.1 82.36,24.45 v82.8,24.89
  Bottom 0.406: L4.1 v82.8,24.89
CAR+5V_CT  (via drill 0.4)
  Top 0.406: L3.1 81.79,33.53 84.33,30.99 88.39,30.99 90.83,28.55 v90.83,27.43
  Bottom 0.406: C6.1 C7.1 90.27,23.82 90.78,24.33 IC4.3 90.78,27.38 v90.83,27.43
CAR+12V  (via drill 0.6)
  Top 0.508: DCDC1.2 76.66,21.79
  Top 0.61: DCDC1.2 76.66,21.29 | C28.1 82.3,14.22 81.28,15.24 81.28,17.78 82.41,18.91 L1.2
  Top 0.813: DCDC1.2 76.66,22.2 77.62,23.16 v80.47,23.16 81.69,23.16 83.59,21.26 C3.+ 84.45,19.43 83.93,18.91 L1.2
  Bottom 0.406: v80.47,23.16 79.05,24.59 79.05,33.73 79.58,34.27 IC5.8
CAR+12VIN
  Top 0.61: 86.87,12.7 85.59,12.7 C29.1
  Top 1.016: K3.4 89.81,45.52 86.56,42.27 86.56,39.93 93.07,33.43 93.07,22.35 91.97,21.26 C2.+ 88.9,18.29 86.87,16.26 86.87,15.75 | K4.1 90.04,9.53 86.87,12.7 86.87,15.75 | L1.1 83.44,16.13 83.82,15.75 86.87,15.75
CAR_CANRX  (via drill 0.4)
  Top 0.203: IC3.3 78.13,27.13 v80.16,29.16
  Bottom 0.203: R14.2 80.26,29.26 v80.16,29.16
CAR_CANRX_T  (via drill 0.4)
  Top 0.203: v91.44,29.46 91.44,31.09 90.93,31.6 84.63,31.6 83.11,33.12 v83.11,33.53
  Bottom 0.203: IC4.4 89.51,27.53 v91.44,29.46 | v83.11,33.53 83.11,32.92 82.7,32.51 81.04,32.51 R14.1
CAR_CANTX  (via drill 0.4)
  Top 0.203: IC3.2 78.38,25.86 v80.77,28.25
  Bottom 0.203: R13.2 82.3,29.77 v80.77,28.25
CAR_CANTX_T  (via drill 0.4)
  Top 0.203: v91.95,27.43 92.05,27.43 92.25,27.64 92.25,30.89 91.14,32 85.65,32 v84.12,33.53
  Bottom 0.203: IC4.1 93.32,26.06 v91.95,27.43 | R13.1 83.15,31.74 84.12,32.72 v84.12,33.53
CARGND  (via drill 0.4, 0.6, 1)
  Top 0.406: 83.31,27.43 81.83,25.95 C8.2 C18.2 | IC3.4 77.67,30.12 v78.03,30.48
  Top 0.61: K4.4 81.79,9.91 81.79,11.18 82.8,12.19 C29.2 83.58,13.74 C28.2 | v82.12,42.65 79.22,42.65 78.5,41.92 C19.2 C20.2
  Top 1.016: DCDC1.1 79.2,19.46 v78.03,18.29 | C2.- v87.38,24.46 C3.- 84.45,26.29 83.31,27.43 81.28,30.48 v78.03,30.48
  Bottom 0.203: R12.2 93.43,35.6 94.08,34.95 94.08,23.98 93.57,23.47
  Bottom 0.406: v87.38,24.46 87.38,21.84 88.18,21.04 C7.2 C6.2 93.18,21.04 93.67,21.54 93.67,23.37 93.57,23.47 93.27,23.77 92.46,23.77 92.05,24.18 IC4.2
  Bottom 0.61: 80.85,43.1 IC5.2 IC5.7 | 80.85,43.1 79.92,44.03 | 80.85,43.1 80.87,43.08 81.69,43.08 v82.12,42.65 IC5.3 IC5.6
  Bottom 1.016: K4.4 81.4,9.63 78.03,13.01 v78.03,18.29 v78.03,30.48 78.03,42.14 79.92,44.03 K3.1
CR1  (via drill 0.6)
  Top 0.406: RP1.2 v19.05,44.77
  Bottom 0.406: QB1.3 v19.05,44.77
CR2  (via drill 0.6)
  Top 0.406: RP2.2 v23.5,44.77
  Bottom 0.406: QB2.3 v23.5,44.77
CR3  (via drill 0.6)
  Top 0.406: RP3.2 v27.94,44.77
  Bottom 0.406: QB3.3 v27.94,44.77
CR4  (via drill 0.6)
  Top 0.406: RP4.2 v32.38,44.77
  Bottom 0.406: QB4.3 v32.38,44.77
CR5  (via drill 0.6)
  Top 0.406: RP5.2 v36.83,44.77
  Bottom 0.406: QB5.3 v36.83,44.77
CR6  (via drill 0.6)
  Top 0.406: RP6.2 v41.27,44.77
  Bottom 0.406: QB6.3 v41.27,44.77
CR7  (via drill 0.6)
  Top 0.406: RP7.2 v45.72,44.77
  Bottom 0.406: QB7.3 v45.72,44.77
CR8  (via drill 0.6)
  Top 0.406: RP8.2 v50.16,44.77
  Bottom 0.406: QB8.3 v50.16,44.77
CR9  (via drill 0.6)
  Top 0.406: RP9.2 v54.61,44.77
  Bottom 0.406: QB9.3 v54.61,44.77
CR10  (via drill 0.6)
  Top 0.406: RP10.2 v59.05,44.77
  Bottom 0.406: QB10.3 v59.05,44.77
CR11  (via drill 0.6)
  Top 0.406: RP11.2 v63.5,44.77
  Bottom 0.406: QB11.3 63.44,44.83 v63.5,44.77
CR12  (via drill 0.6)
  Top 0.406: RP12.2 v67.94,40.93
  Bottom 0.406: QB12.3 v67.94,40.93
CSB
  Top 0.203: R1.2 36.91,27.3 42.27,21.95 48.36,21.95 50.8,19.51 56.08,19.51 58.59,22.01 | IC2.44 58.59,22.01 | RCSB3.1 58.62,22.05 58.59,22.01
DBGEN  (via drill 0.4)
  Top 0.203: C16.1 25.52,3.06 JP1.5 | R8.2 C16.1 | v19.71,12.6 19.71,16.48 v19.68,16.51 | IC1.28 v21.74,21.75 v21.74,21.74 | C16.1 25.52,8.2 C25.1
  Bottom 0.203: JP1.5 26.04,6.35 19.68,12.7 19.68,12.62 v19.71,12.6 | v19.68,16.51 19.68,19.68 v21.74,21.74
ERROR_LED  (via drill 0.4)
  Top 0.203: IC1.1 28.76,16.96 v28.96,16.76 | v32,14.73 32,13.11 v32.11,13.01 | R15.1 v37.59,11.18
  Bottom 0.203: v28.96,16.76 29.06,16.76 29.77,16.05 30.68,16.05 v32,14.73 | v37.59,11.18 36.58,12.19 32.92,12.19 v32.11,13.01
ERROR_LED_G
  Top 0.203: R15.2 37.83,8.39 38.61,7.62 38.61,4.06 39.62,3.05 39.62,2.78 Q4.1
FSM  (via drill 0.4)
  Top 0.203: IC2.29 51.09,27.52 v51.61,28.04
  Bottom 0.203: RFSM1.1 RFSM2.2 59.38,31.13 CFSM.2 59.02,30.98 56.08,28.04 v51.61,28.04
GND  (via drill 0.4, 0.6, 1)
  Top 0.203: 56.08,28.04 56.29,28.04 56.59,27.74 IC2.40 | 56.08,28.04 55.68,28.04 | 55.68,28.04 55.07,28.04 | 55.07,28.04 54.66,28.04 | 54.66,28.04 54.05,28.04 | 54.05,28.04 53.03,28.04 | IC2.33 53.09,27.99 53.03,28.04 | IC2.35 54.09,28 54.05,28.04 | IC2.36 54.59,27.97 54.66,28.04 | IC2.37 55.09,28.02 55.07,28.04 | IC2.38 55.59,27.95 55.68,28.04 | IC2.39 56.09,28.04 56.08,28.04 | v26.67,19.68 26.73,19.75 IC1.5 30.24,19.75 31.08,18.91 C17.2 C24.2 | IC1.41 23.58,17.87 v24.13,18.41 | JP1.6 23.5,5.08 | 23.5,5.08 20.32,8.26 16.51,8.26 13.97,5.71 13.97,2.54 13.34,1.91 11.12,1.91 K5.1 K5.2 K5.3 K5.4 K5.5 K5.6 K5.7 | 23.5,5.08 24.02,5.6 C16.2 24.02,8.2 C25.2 | 53.03,28.04 52.22,28.85 51.21,28.85 50.09,27.74 IC2.27 50.09,24.69 v49.99,24.59 49.78,24.38 46.74,24.38 45.47,25.65 V-R.2
  Top 0.406: 61.77,30.89 61.77,32.18 CV.2 | D1.A 70.71,31.45 70.64,31.37 v71.53,30.48 | Q4.2 41.79,2.85 v42.75,3.81 | Q3.2 46.24,2.85 v47.19,3.81 47.19,7.47 47.14,7.52 R38.2 47.47,7.47 48.9,8.89 48.9,15.24 50.16,16.51 50.16,17.27 49.53,17.91 v43.31,17.91 | 68.34,21.55 68.28,21.49 | CVREG.1 CVREF.1 49.99,23.53 v49.99,24.59 | C11.2 C23.2 C13.2 30.05,12.08 32.4,12.08 33.02,12.7 33.02,15.37 v32.93,15.46 | v26.67,22.76 28.09,24.18 30.48,24.18 30.75,23.91 C10.2 31.29,23.98 31.84,24.52 C22.2 C12.2 35.93,24.52 41.66,18.8 45.21,18.8 45.31,18.69 49.89,18.69 50.8,17.78 56.9,17.78 60.05,20.93 60.76,20.93 61.77,21.95 61.77,23.57 62.38,24.18 v62.59,24.18 | C9.2 67.87,21.54 68.03,21.37 | C21.2 69.6,21.49 | IC3.5 68.12,28.4 v68.07,28.35 | C5.- 61.16,20.02 | 61.16,20.02 60.25,20.02 58.27,18.03 D4.A 57.25,16.61 56.9,16.26 56.9,12.7 57.4,12.19 60.69,12.19 C27.2 | 61.16,20.02
  Top 0.61: C1.- 64.2,25.33 v64.14,25.4 61.77,27.76 61.77,30.89 | DCDC1.4 69.6,21.49 68.28,21.49 68.15,21.49 68.03,21.37 C4.- C5.- | C1.- 66.37,24 | C26.2 63.26,11.18 C27.2 | C1.- 65.96,28.37 68.96,31.37 70.64,31.37
  Top 0.813: 66.37,24 66.37,20.52 C4.-
  Bottom 0.203: RGQ1_3.1 71.64,53.29 Q2.2 71.64,51.3 72.14,50.8 72.14,31.09 v71.53,30.48 | 61.57,27.08 61.27,27.18 RFSM2.1 61.22,29.48 CFSM.1
  Bottom 0.406: v24.13,18.41 25.4,19.68 v26.67,19.68 | v26.67,19.68 v26.67,22.76 26.67,29.21 25.2,30.68 NTC_C6.2 NTC_C0.2 NTC_C1.2 NTC_C2.2 NTC_C3.2 NTC_C4.2 NTC_C5.2 NTC_C7.2 6.55,30.68 2.54,26.67 2.54,4.57 3.56,3.56 9.07,3.56 K5.1 | v64.14,25.4 62.46,27.08 61.57,27.08 51.26,27.08 49.99,25.81 v49.99,24.59 v43.31,17.91 42.55,17.14 C15.1 | C14.1 v38.1,19.05 38.1,18.93 C15.1 | C15.1 36.31,15.99 35.05,14.73 33.66,14.73 v32.93,15.46 31.62,16.76 30.21,16.76 27.23,19.75 26.73,19.75 v26.67,19.68 | v42.75,3.81 v47.19,3.81 | v68.07,28.35 68.07,27.53 64.52,23.98 62.79,23.98 v62.59,24.18
  pour Top: 20.52,24.28 28.14,24.28 28.14,16.66 20.52,16.66
LED1C
  Top 0.406: LED1.C R38.1
LED1C1
  Top 0.406: R10.1 LED2.C
LED1C2
  Top 0.406: LED3.C R11.1
MISO1
  Top 0.203: IC1.26 18.7,22.75 18.29,23.16 18.29,23.98 25.43,31.11 R4.1
MOSI1  (via drill 0.4)
  Top 0.203: IC1.38 22.08,18.91 v22.86,19.68 | v22.86,26.67 22.86,27.3 25.63,30.07 33.53,30.07 34.17,29.43 R5.1
  Bottom 0.203: v22.86,19.68 v22.86,26.67
Q1G  (via drill 0.6)
  Top 0.406: D2.A 65.44,51.6 65.84,51.21 v66.45,51.21 68.13,51.21 RGQ1_1.2 69.02,51.66 RGQ1_2.2
  Bottom 0.406: Q1.1 65.08,51.76 65.63,51.21 v66.45,51.21
Q2D  (via drill 0.4)
  Top 0.203: RGQ1_2.1 71.32,51.66 v71.32,47.95
  Bottom 0.203: Q2.3 70.69,48.59 v71.32,47.95
Q3_COL
  Top 0.406: R10.2 43.81,6.18 Q3.3
Q3_COL1
  Top 0.406: R11.2 Q4.3
QBG1
  Bottom 0.203: RBG1.1 17.26,45.2 17.78,45.72 17.78,48.41 QB1.1
QBG2
  Bottom 0.203: RBG2.1 21.7,45.2 22.23,45.72 22.23,48.41 QB2.1
QBG3
  Bottom 0.203: RBG3.1 26.15,45.2 26.67,45.72 26.67,48.41 QB3.1
QBG4
  Bottom 0.203: RBG4.1 30.59,45.2 31.11,45.72 31.11,48.41 QB4.1
QBG5
  Bottom 0.203: RBG5.1 35.04,45.2 35.56,45.72 35.56,48.41 QB5.1
QBG6
  Bottom 0.203: RBG6.1 39.48,45.2 40.01,45.72 40.01,48.41 QB6.1
QBG7
  Bottom 0.203: RBG7.1 43.93,45.2 44.45,45.72 44.45,48.41 QB7.1
QBG8
  Bottom 0.203: RBG8.1 48.38,45.2 48.9,45.72 48.9,48.41 QB8.1
QBG9
  Bottom 0.203: RBG9.1 52.82,45.2 53.34,45.72 53.34,48.41 QB9.1
QBG10
  Bottom 0.203: RBG10.1 57.27,45.2 57.78,45.72 57.78,48.41 QB10.1
QBG11
  Bottom 0.203: RBG11.1 61.71,45.2 62.23,45.72 62.23,48.51 QB11.1
QBG12
  Bottom 0.203: RBG12.1 66.56,45.2 66.65,44.7 66.65,44.62 QB12.1
RS
  Bottom 0.203: IC4.8 93.32,33.54 R12.1
SCK  (via drill 0.4)
  Top 0.203: R3.2 38,25.4 41.86,21.54 47.95,21.54 50.39,19.1 v56.9,19.1 | IC2.41 57.09,25.39 v56.08,24.38
  Bottom 0.203: v56.08,24.38 56.08,19.91 v56.9,19.1 57.77,19.98 RCSB.1
SCK1
  Top 0.203: IC1.13 27.08,25.18 27.3,25.4 R3.1
SDI  (via drill 0.4)
  Top 0.203: R5.2 35.81,29.21 42.67,22.35 48.77,22.35 51.21,19.91 55.27,19.91 v56.9,21.54 | IC2.42 57.59,24.47 v56.9,23.77
  Bottom 0.203: v56.9,23.77 v56.9,21.54 58.33,21.54 RCSB1.1
SDO  (via drill 0.4)
  Top 0.203: R4.2 35.53,31.11 37.39,29.26 37.39,28.45 43.08,22.76 49.17,22.76 51.61,20.32 54.46,20.32 56.9,22.76 57.51,22.76 v57.71,22.96 58.09,23.34 IC2.43
  Bottom 0.203: RCSB2.1 59.23,24.49 v57.71,22.96
SSEL  (via drill 0.4)
  Top 0.203: IC1.2 30.01,18.25 v30.28,17.98 | R1.1 34.17,27.39 33.33,28.25 v32.31,28.25
  Bottom 0.203: v30.28,17.98 29.84,18.41 29.84,26.19 31.9,28.25 v32.31,28.25
SWCLK  (via drill 0.4)
  Top 0.203: v20.95,13.97 20.95,17.09 21.54,17.68 21.54,20.73 21.02,21.25 IC1.29
  Bottom 0.203: JP1.3 31.11,3.81 v20.95,13.97
V+  (via drill 0.4)
  Top 0.203: IC2.1 58.59,34.61 59.13,35.15
  Top 0.406: D1.C 69.64,37.04 v68.78,36.17 68.68,36.17 65.96,33.45 | C1.+ 65.96,33.45 | 65.96,33.45 63.57,35.84 v63.3,35.84 CV.1 61.24,35.15 59.13,35.15
  Bottom 0.203: RFSM1.2 61.78,34.33 v63.3,35.84
  Bottom 0.406: Q1.3 67.31,52.7 67.94,52.07 67.94,48.08 70.1,45.92 70.1,37.49 v68.78,36.17
V+S  (via drill 0.4)
  Top 0.406: 63.03,53.8 D2.C 65.39,53.8 65.63,54.05 v66.45,54.05 68.28,54.05 RGQ1_1.1 | 63.03,53.8 62.99,53.85 | V+R.2 62.65,53.41 63.03,53.8
  Bottom 0.406: Q1.2 65.24,53.66 65.63,54.05 v66.45,54.05
VREF
  Top 0.203: IC2.31 52.09,24.09 CVREF.2
VREG  (via drill 0.4)
  Top 0.203: IC2.32 52.59,24.26 CVREG.2 53.34,24.69 v53.24,24.79 | v60.96,26.21 60.96,24.47 R2.2 60.97,22.78 RCSB3.2
  Bottom 0.203: v53.24,24.79 53.24,25.6 54.05,26.42 60.76,26.42 v60.96,26.21 61.05,26.12 RCSB2.2 61.02,24.46 R2.2 60.95,24.44 60.95,22.76 60.82,22.63 RCSB1.2 59.27,20.98 RCSB.2
WDTB  (via drill 0.4)
  Top 0.203: IC2.34 53.59,25.45 v54.25,24.79 | v60.15,25.6 60.15,25.13 R2.1
  Bottom 0.203: v54.25,24.79 54.25,25.4 54.86,26.01 59.74,26.01 v60.15,25.6
XTALIN  (via drill 0.4)
  Top 0.203: IC1.6 30.75,20.25 v31.09,19.91
  Bottom 0.203: v31.09,19.91 31.78,19.22 Y1.2 34.12,17.83 C15.2
XTALOUT  (via drill 0.4)
  Top 0.203: IC1.7 30.91,20.75 v31.11,20.95
  Bottom 0.203: v31.11,20.95 32.92,22.76 35.36,22.76 35.73,22.39 Y1.1 36.01,21.7 C14.2